# EAGLE board PX4mNode_V0_1_1 (EAGLE 6.5.0), part 1 of 2
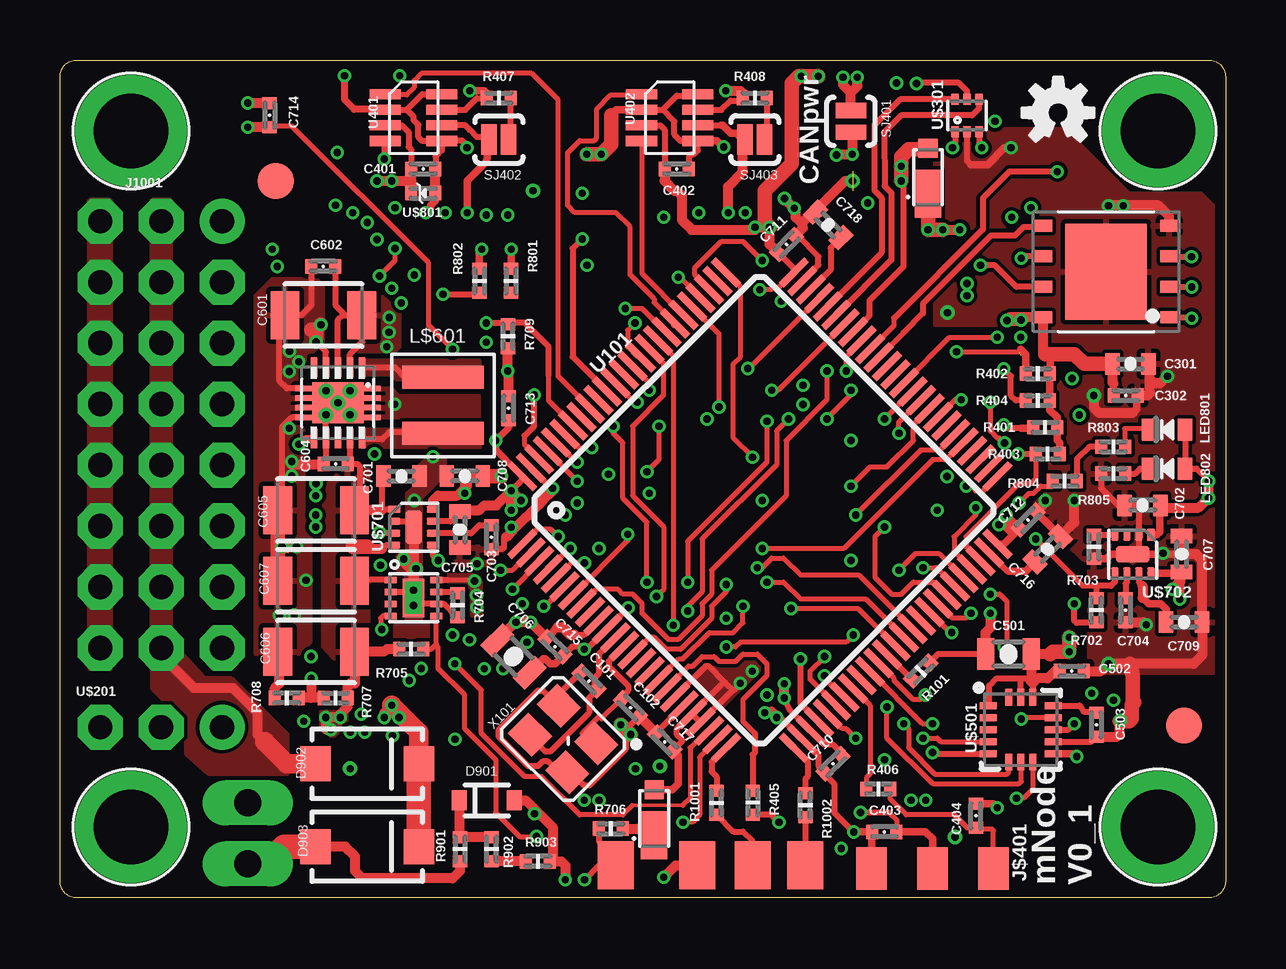
[diagram p11: board, top side]
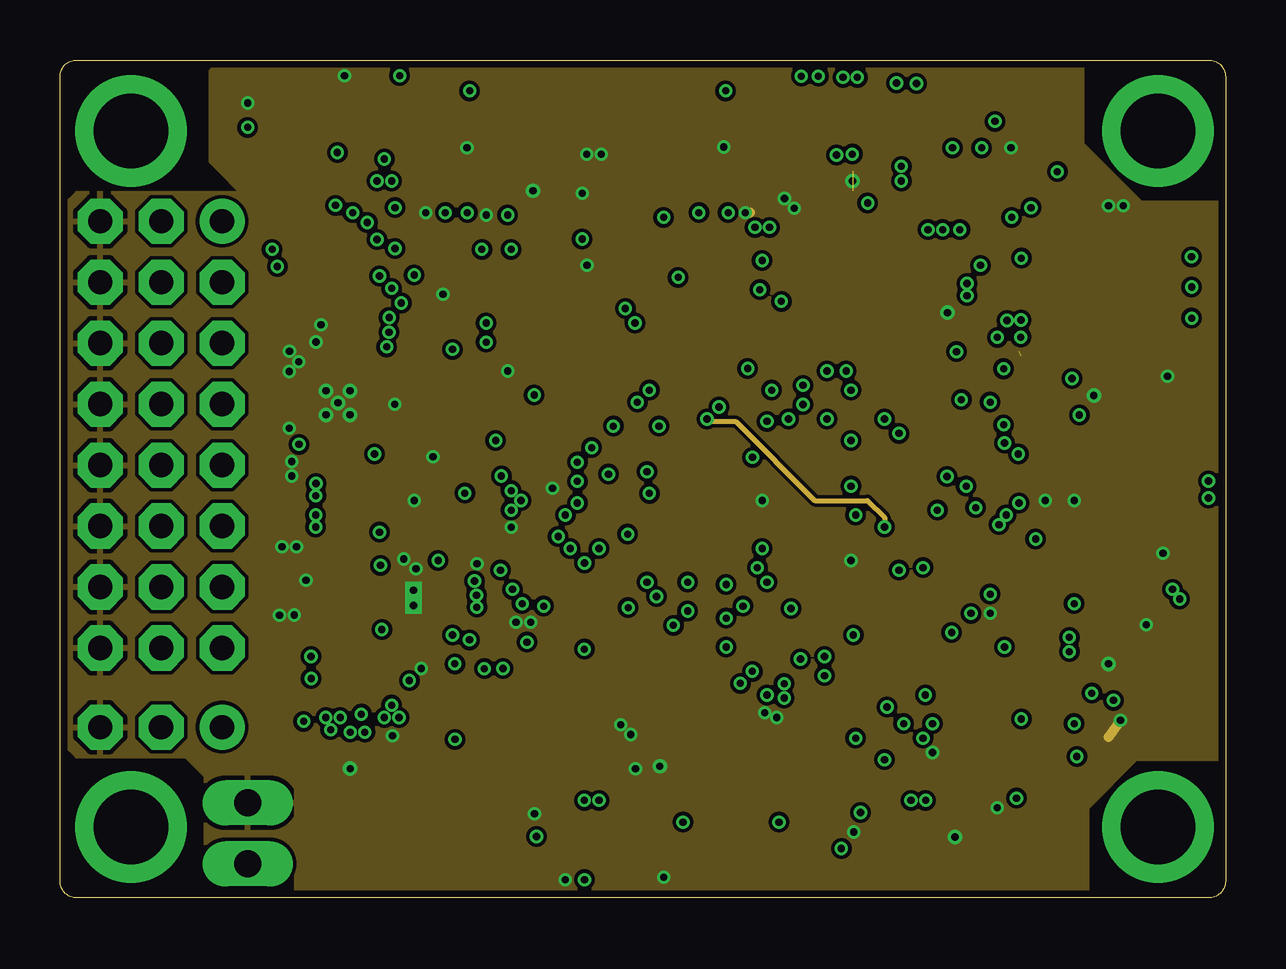
[diagram p12: board, inner layer Ground]
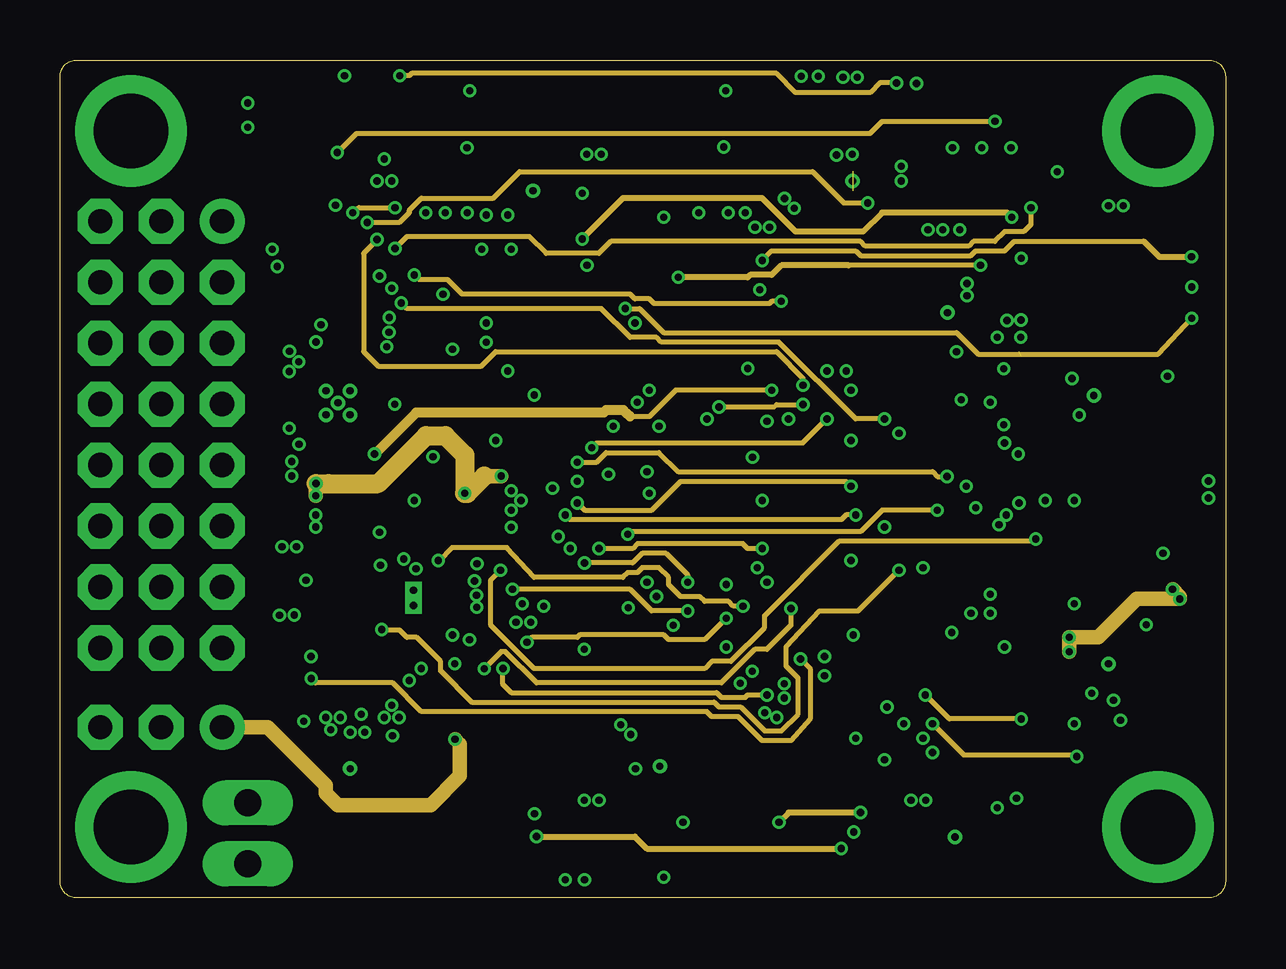
[diagram p13: board, inner layer Horizontal]
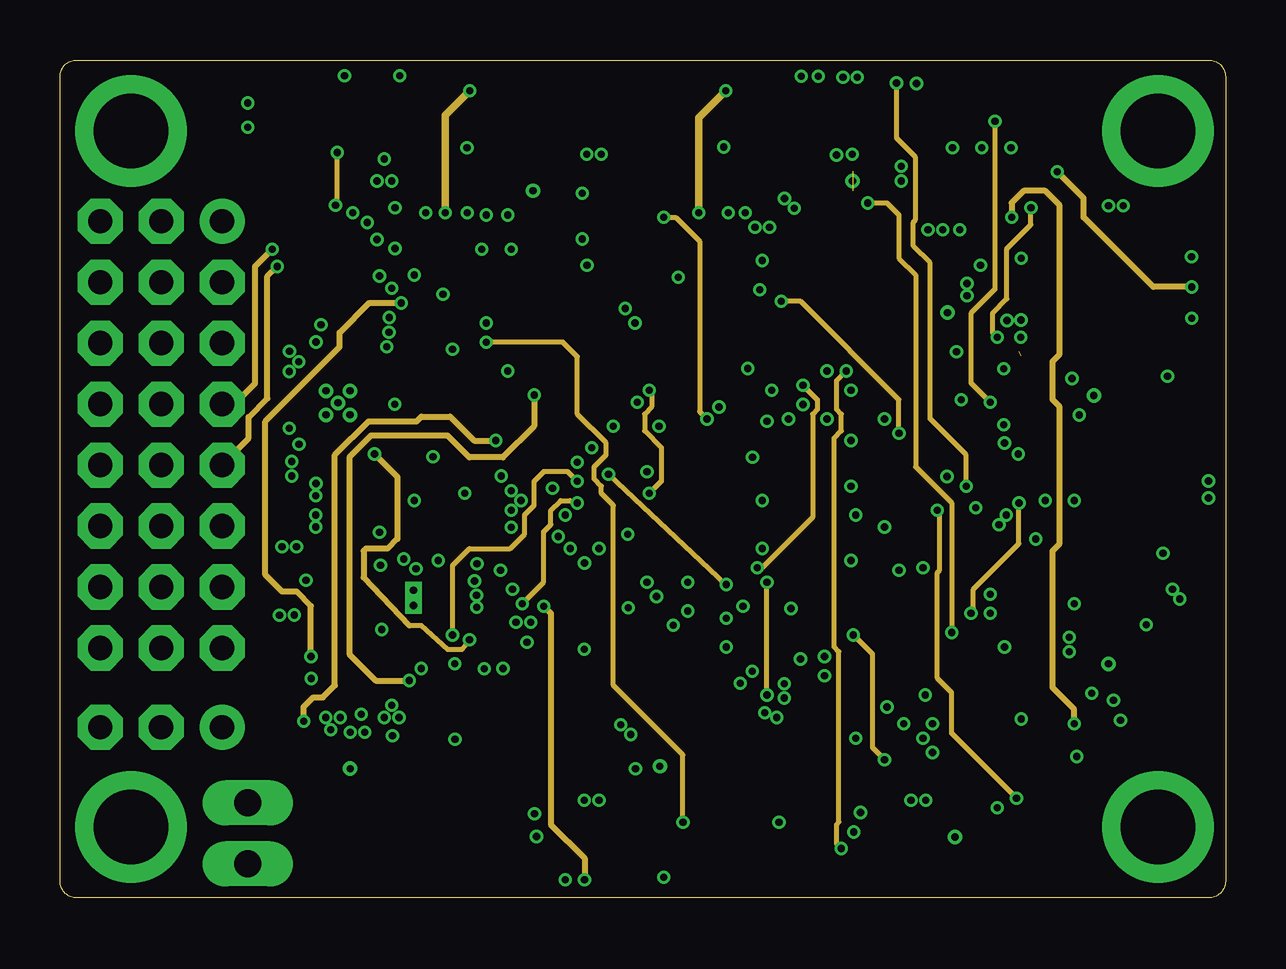
[diagram p14: board, inner layer Vertical]
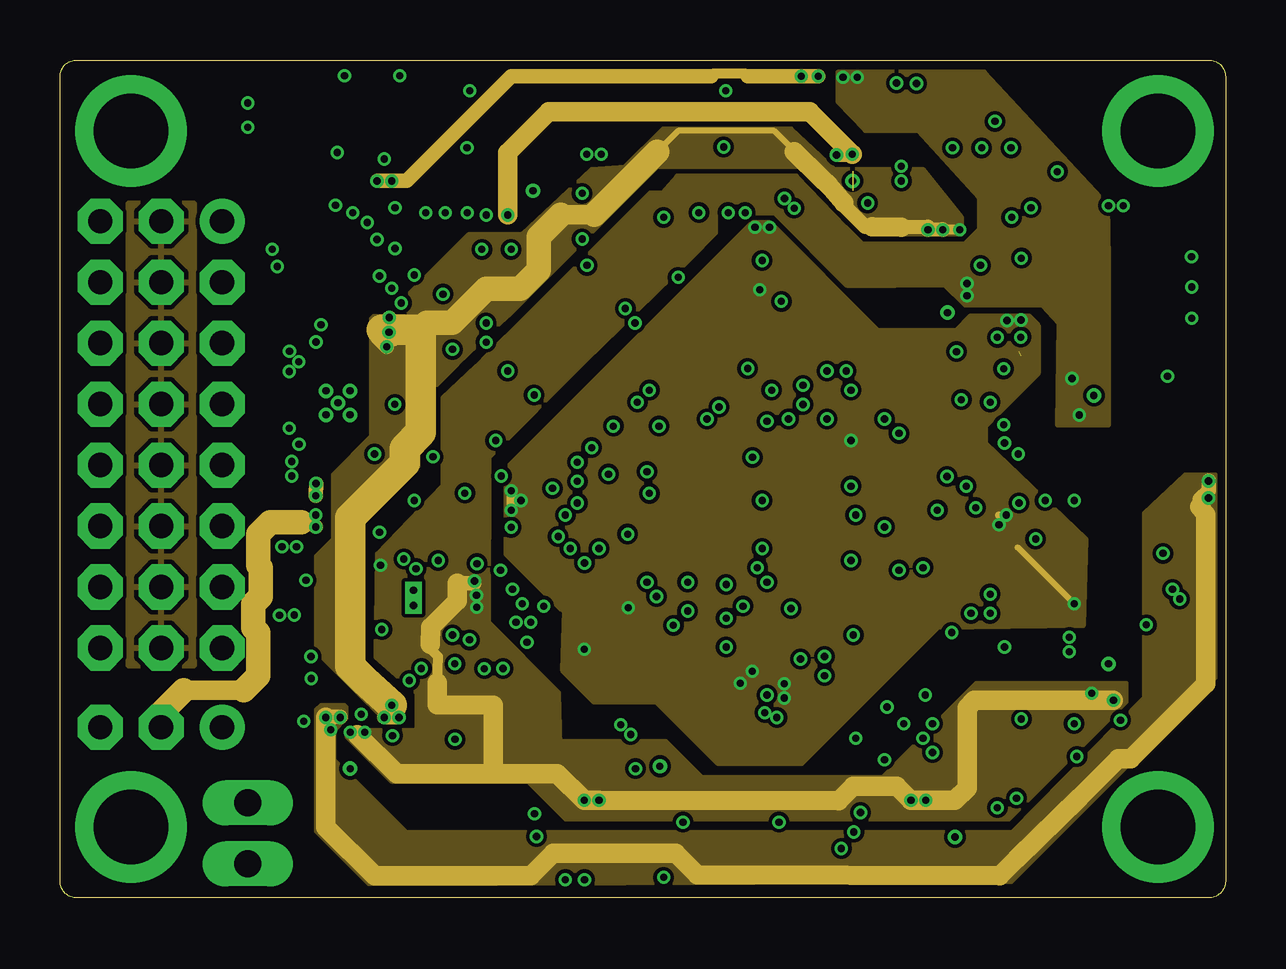
[diagram p15: board, inner layer Power]
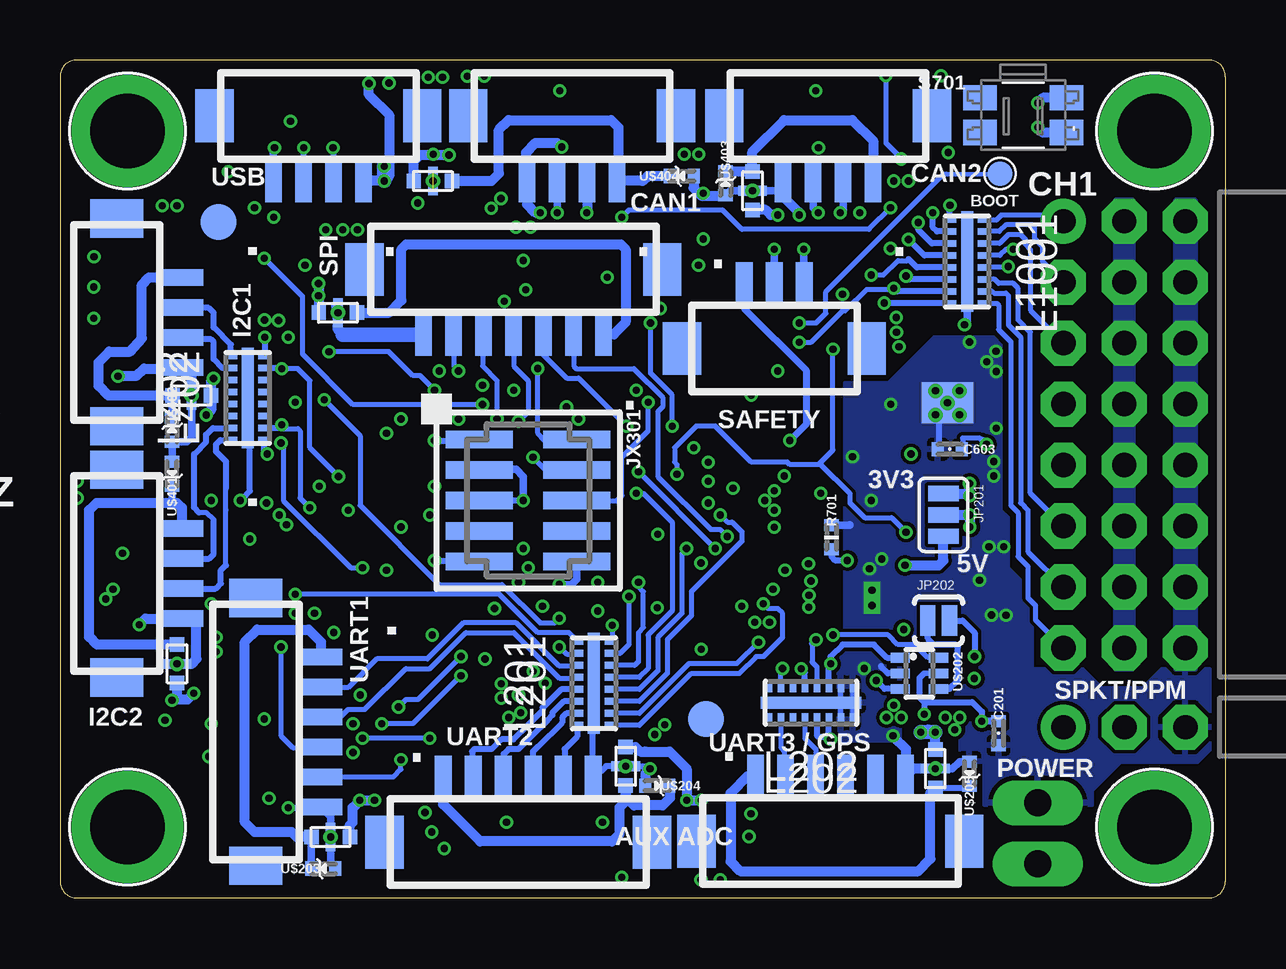
[diagram p16: board, bottom side, seen from below]

Size 48.56 x 34.91 mm. Coordinates in mm from the lower left corner, seen from the top.
Outline: 0,0.7 arc90 0.7,0 47.86,0 arc90 48.56,0.7 48.56,34.21 arc90 47.86,34.91 0.7,34.91 arc90 0,34.21
Outline: 0,0.68 0,34.21
Copper layers (1+2+3*14+15+16): Top 0.035mm / dielectric 0.2mm / Ground 0.035mm / dielectric 0.36mm / Horizontal 0.035mm / dielectric 0.28mm / Vertical 0.035mm / dielectric 0.36mm / Power 0.035mm / dielectric 0.2mm / Bottom 0.035mm
Design rules "PCB-POOL HighSpec_ML6 *": minimum track width 0.125mm, minimum drill 0.3mm, track to track 0.125mm, track to pad 0.125mm, pad to pad 0.125mm, via to via 0.125mm, smd to smd 0.125mm, copper to edge 0.3mm, drill to drill 0.2mm, minimum pad ring 0.125mm, minimum via ring 0.125mm, stop-mask expansion 0.075mm, vias tented up to drill 0.31mm, thermal gap 0.2mm
Net classes: 0 signal: width 0.152 mm, drill 0.2 mm, clearance 0.152 mm; 1 power: width 0.254 mm, drill 0.3 mm, clearance 0.152 mm

## Footprints (pad centres in the part's own frame; a part is rotated, then mirrored left to right if it is on the bottom)
PAD.04X.04 = smd 1.016 x 1.016: P$1 0,0
0402-CAP = smd 0.5 x 0.6: P$1 -0.5,0; P$2 0.5,0
0603-CAP = smd 0.6 x 0.9: P$1 -0.75,0; P$2 0.75,0
0805-CAP = smd 0.7 x 1.3: P$1 -0.95,0; P$2 0.95,0
1210 = smd 1.2 x 2: 1 -1.6,0; 2 1.6,0
MICROSMP = smd 0.8 x 0.8: ANODE 0.65,0 | smd 2 x 1.1: CATHODE -1.25,0
SOD-323 = smd 0.63 x 0.83: 1 -1.15,0; 2 1.15,0
SMA-DIODE = smd 1.27 x 1.47: A -2.15,0; C 2.15,0
DF13C-6P-1.25V = smd 1.6 x 2.2: M$0 5.575,-1.8; M$1 -5.575,-1.8 | smd 0.7 x 1.8: P$1 -3.125,0.9; P$2 -1.875,0.9; P$3 -0.625,0.9; P$4 0.625,0.9; P$5 1.875,0.9; P$6 3.125,0.9
DF13C-4P-1.25V = smd 1.6 x 2.2: M$0 4.325,-1.8; M$1 -4.325,-1.8 | smd 0.7 x 1.8: P$1 -1.875,0.9; P$2 -0.625,0.9; P$3 0.625,0.9; P$4 1.875,0.9
DF13C-7P-1.25V = smd 1.6 x 2.2: M$0 6.2,-1.8; M$1 -6.2,-1.8 | smd 0.7 x 1.8: P$1 -3.75,0.9; P$2 -2.5,0.9; P$3 -1.25,0.9; P$4 0,0.9; P$5 1.25,0.9; P$6 2.5,0.9; P$7 3.75,0.9
DF13C-3P-1.25V = smd 1.6 x 2.2: M$0 3.85,-1.8; M$1 -3.85,-1.8 | smd 0.7 x 1.8: P$1 -1.25,0.9; P$2 0,0.9; P$3 1.25,0.9
3X8RA_SERVO = drill 1.016 pad 1.88 octagon: GND_S1 -3.81,8.89; GND_S2 -3.81,6.35; GND_S3 -3.81,3.81; GND_S4 -3.81,1.27; GND_S5 -3.81,-1.27; GND_S6 -3.81,-3.81; GND_S7 -3.81,-6.35; GND_S8 -3.81,-8.89; PWR_S1 -1.27,8.89; PWR_S2 -1.27,6.35; PWR_S3 -1.27,3.81; PWR_S4 -1.27,1.27; PWR_S5 -1.27,-1.27; PWR_S6 -1.27,-3.81; PWR_S7 -1.27,-6.35; PWR_S8 -1.27,-8.89; S2 1.27,6.35; S3 1.27,3.81; S4 1.27,1.27; S5 1.27,-1.27; S6 1.27,-3.81; S7 1.27,-6.35; S8 1.27,-8.89 | drill 1.016 pad 1.88: S1 1.27,8.89
HEADER_3X01_SMD_H_BOARD_EDGE_SHORT = smd 1.27 x 1.778: 1 -2.54,0; 2 0,0; 3 2.54,0
SJ_3 = smd 0.635 x 1.27: 1 -0.889,0; 2 0,0; 3 0.889,0
SJ_2S-NO = smd 0.635 x 1.27: 1 -0.45,0; 2 0.45,0
PAD-1.5X4.5 = smd 1.5 x 2: P$1 0,0
1X02_LONGPADS = drill 1.118 pad 1.88 long: 1 0,0; 2 2.54,0
FIDUCIAL-1.5X3 = smd 1.5 x 1.5: 1 0,0
FTSH-105-01-XXX-DV-K = smd 0.737 x 2.794: 1 -2.54,-2.032; 2 -2.54,2.032; 3 -1.27,-2.032; 4 -1.27,2.032; 5 0,-2.032; 6 0,2.032; 7 1.27,-2.032; 8 1.27,2.032; 9 2.54,-2.032; 10 2.54,2.032
DFN16-THIN = smd 0.28 x 0.51: P$1 -1.75,-0.7; P$2 -1.25,-0.7; P$3 -0.75,-0.7; P$4 -0.25,-0.7; P$5 0.25,-0.7; P$6 0.75,-0.7; P$7 1.25,-0.7; P$8 1.75,-0.7; P$9 1.75,0.7; P$10 1.25,0.7; P$11 0.75,0.7; P$12 0.25,0.7; P$13 -0.25,0.7; P$14 -0.75,0.7; P$15 -1.25,0.7; P$16 -1.75,0.7 | smd 4.2 x 0.5: P$EP 0,0
KYOCERA-KNH16-DA = smd 0.6 x 0.6: P$1 -0.8,0; P$2 0.8,0 | smd 0.4 x 0.4: P$3 0,-0.4; P$4 0,0.4 | drill 0.3 pad 0.6: P$5 0,0
XFL4020 = smd 0.965 x 3.404: 1 -1.168,0; 2 1.168,0
0603-LED = smd 0.6 x 0.9: A 0.75,0; C -0.75,0
MOUNT-HOLE3.1 = drill 3.1 pad 4.1: P$1 0,0
0402-RES = smd 0.5 x 0.6: P$1 -0.5,0; P$2 0.5,0
EVQP7J01K = smd 1.4 x 1.05: A1 -1.8,0.725; A2 1.8,0.725; B3 -1.8,-0.725; B4 1.8,-0.725
SJ_2S-NOTRACE = smd 0.635 x 1.27: 1 -0.401,0; 2 0.413,0
TQFP100 = smd 1.5 x 0.29: 1 -8,6; 2 -8,5.5; 3 -8,5; 4 -8,4.5; 5 -8,4; 6 -8,3.5; 7 -8,3; 8 -8,2.5; 9 -8,2; 10 -8,1.5; 11 -8,1; 12 -8,0.5; 13 -8,0; 14 -8,-0.5; 15 -8,-1; 16 -8,-1.5; 17 -8,-2; 18 -8,-2.5; 19 -8,-3; 20 -8,-3.5; 21 -8,-4; 22 -8,-4.5; 23 -8,-5; 24 -8,-5.5; 25 -8,-6; 51 8,-6; 52 8,-5.5; 53 8,-5; 54 8,-4.5; 55 8,-4; 56 8,-3.5; 57 8,-3; 58 8,-2.5; 59 8,-2; 60 8,-1.5; 61 8,-1; 62 8,-0.5; 63 8,0; 64 8,0.5; 65 8,1; 66 8,1.5; 67 8,2; 68 8,2.5; 69 8,3; 70 8,3.5; 71 8,4; 72 8,4.5; 73 8,5; 74 8,5.5; 75 8,6 | smd 0.29 x 1.5: 26 -6,-8; 27 -5.5,-8; 28 -5,-8; 29 -4.5,-8; 30 -4,-8; 31 -3.5,-8; 32 -3,-8; 33 -2.5,-8; 34 -2,-8; 35 -1.5,-8; 36 -1,-8; 37 -0.5,-8; 38 0,-8; 39 0.5,-8; 40 1,-8; 41 1.5,-8; 42 2,-8; 43 2.5,-8; 44 3,-8; 45 3.5,-8; 46 4,-8; 47 4.5,-8; 48 5,-8; 49 5.5,-8; 50 6,-8; 76 6,8; 77 5.5,8; 78 5,8; 79 4.5,8; 80 4,8; 81 3.5,8; 82 3,8; 83 2.5,8; 84 2,8; 85 1.5,8; 86 1,8; 87 0.5,8; 88 0,8; 89 -0.5,8; 90 -1,8; 91 -1.5,8; 92 -2,8; 93 -2.5,8; 94 -3,8; 95 -3.5,8; 96 -4,8; 97 -4.5,8; 98 -5,8; 99 -5.5,8; 100 -6,8
SOT23-8 = smd 0.42 x 1.3: 1 -0.975,-1.175; 2 -0.325,-1.175; 3 0.325,-1.175; 4 0.975,-1.175; 5 0.975,1.175; 6 0.325,1.175; 7 -0.325,1.175; 8 -0.975,1.175
3X1RA = drill 1.016 pad 1.88: 1 5.08,0 | drill 1.016 pad 1.88 octagon: 2 2.54,0; 3 0,0
SOT363_PHILIPS = smd 0.4 x 0.8: 1 -0.65,-0.8; 2 0,-0.8; 3 0.65,-0.8; 4 0.65,0.8; 5 0,0.8; 6 -0.65,0.8
0402-TVS = smd 0.5 x 0.6: A 0.5,0; C -0.5,0
SOT563-6 = smd 0.3 x 0.45: 1 -0.5,-0.675; 2 0,-0.675; 3 0.5,-0.675; 4 0.5,0.675; 5 0,0.675; 6 -0.5,0.675
WSON-8-5X6 = smd 0.5 x 0.75: 1 -1.905,-2.625; 2 -0.635,-2.625; 3 0.635,-2.625; 4 1.905,-2.625; 5 1.905,2.625; 6 0.635,2.625; 7 -0.635,2.625; 8 -1.905,2.625 | smd 4 x 3.4: PAD 0,0
16LGA-3X3 = smd 0.7 x 0.3: 1 -1.35,1; 2 -1.35,0.5; 3 -1.35,0; 4 -1.35,-0.5; 5 -1.35,-1; 9 1.35,-1; 10 1.35,-0.5; 11 1.35,0; 12 1.35,0.5; 13 1.35,1 | smd 0.3 x 0.7: 6 -0.5,-1.35; 7 0,-1.35; 8 0.5,-1.35; 14 0.5,1.35; 15 0,1.35; 16 -0.5,1.35
PWSON10 = smd 0.28 x 0.85: 1 -1,-1.475; 2 -0.5,-1.475; 3 0,-1.475; 4 0.5,-1.475; 5 1,-1.475; 10 1,1.475; 11 0.5,1.475; 12 0,1.475; 13 -0.5,1.475; 14 -1,1.475 | smd 0.7 x 0.23: 6 1.425,-0.6; 7 1.425,-0.2; 8 1.425,0.2; 9 1.425,0.6; 15 -1.425,0.6; 16 -1.425,0.2; 17 -1.425,-0.2; 18 -1.425,-0.6 | drill 0.3 pad 0.61: 19 0.5,0.5; 20 0.5,-0.5; 21 -0.5,-0.5; 22 -0.5,0.5; 23 0,0 | smd 2.15 x 1.7: EP 0,0 | smd 2.15 x 1.7 bottom: EP1 0,0
MLF-8-EPAD = smd 0.5 x 0.3: 1 -0.8,0.75; 2 -0.8,0.25; 3 -0.8,-0.25; 4 -0.8,-0.75; 5 0.8,-0.75; 6 0.8,-0.25; 7 0.8,0.25; 8 0.8,0.75 | smd 0.7 x 1.4: GND 0,0
QFN8-DSG = smd 0.28 x 0.5: 1 -0.75,-0.95; 2 -0.25,-0.95; 3 0.25,-0.95; 4 0.75,-0.95; 5 0.75,0.95; 6 0.25,0.95; 7 -0.25,0.95; 8 -0.75,0.95 | smd 1.6 x 0.9: GND 0,0 | drill 0.3 pad 0.7 square: P$2 -0.317,0; P$3 0.317,0
OSCILLATOR-3.2X2.5 = smd 1.4 x 1.2: 1 -1.1,-0.85; 2 1.1,-0.85; 3 1.1,0.85; 4 -1.1,0.85

## Placement (x,y rotation side)
BOOT  PAD.04  [PAD.04X.04]  9.4,30.18 0 bottom
C101  8p  [0402-CAP]  22.05,9.04 135 top
C102  8p  [0402-CAP]  23.78,7.92 135 top
C201  0u1  [0402-CAP]  9.46,6.86 270 bottom
C301  2u2  [0603-CAP]  44.6,22.25 0 top
C302  0u1  [0402-CAP]  44.4,20.93 0 top
C401  0u1  [0402-CAP]  15.14,30.38 0 top
C402  0u1  [0402-CAP]  25.71,30.38 0 top
C403  0u1  [0402-CAP]  34.35,2.75 180 top
C404  0u1  [0402-CAP]  38.16,3.42 90 top
C501  10u/10V  [0805-CAP]  39.52,10.16 180 top
C502  10n  [0402-CAP]  42.16,9.45 0 top
C503  0u1  [0402-CAP]  43.18,7.21 270 top
C601  22uF  [1210]  10.97,24.28 180 top
C602  0u1  [0402-CAP]  10.97,26.31 180 top
C603  0u1  [0402-CAP]  11.48,18.69 180 bottom
C604  0u1  [0402-CAP]  11.48,18.08 180 top
C605  22uF  [1210]  10.67,16.15 180 top
C606  22uF  [1210]  10.67,10.26 180 top
C607  22uF  [1210]  10.67,13.21 180 top
C701  2u2  [0603-CAP]  14.22,17.58 0 top
C702  1u0  [0603-CAP]  45.11,16.36 180 top
C703  10n  [0402-CAP]  17.98,15.04 90 top
C704  10n  [0402-CAP]  44.4,11.99 270 top
C705  1u0  [0603-CAP]  16.66,15.34 270 top
C706  10u/10V  [0805-CAP]  18.9,10.06 135 top
C707  1u0  [0603-CAP]  46.74,14.33 90 top
C708  1u0  [0603-CAP]  16.87,17.58 180 top
C709  1u0  [0603-CAP]  46.84,11.49 0 top
C710  0u1  [0402-CAP]  32.21,5.59 225 top
C711  0u1  [0402-CAP]  30.28,27.23 45 top
C712  0u1  [0402-CAP]  40.34,15.75 45 top
C713  0u1  [0402-CAP]  18.69,20.4 90 top
C714  0u1  [0402-CAP]  8.74,32.61 270 top
C715  0u1  [0402-CAP]  20.63,10.46 135 top
C716  2u2  [0603-CAP]  41.15,14.53 45 top
C717  0u1  [0402-CAP]  25.2,6.5 135 top
C718  2u2  [0603-CAP]  32,28.04 135 top
D701  MSS1P4-M3  [MICROSMP]  24.76,3.86 90 top
D901  [SOD-323]  17.78,4.06 0 top
D902  B340A  [SMA-DIODE]  12.8,5.59 0 top
D903  B340A  [SMA-DIODE]  12.8,2.13 0 top
D904  MSS1P4-M3  [MICROSMP]  36.17,30.58 90 top
J201  DF13C-6P-1.25V  [DF13C-6P-1.25V]  38.6,6.92 270 bottom
J202  DF13C-6P-1.25V  [DF13C-6P-1.25V]  29.47,4.12 0 bottom
J203  DF13C-6P-1.25V  [DF13C-6P-1.25V]  16.46,4.17 0 bottom
J301  DF13C-4P-1.25V  [DF13C-4P-1.25V]  37.8,30.78 180 bottom
J401  DF13C-7P-1.25V  [DF13C-7P-1.25V]  29.67,24.38 180 bottom
J402  DF13C-4P-1.25V  [DF13C-4P-1.25V]  44.4,13.51 270 bottom
J403  DF13C-4P-1.25V  [DF13C-4P-1.25V]  44.4,23.98 270 bottom
J404  DF13C-4P-1.25V  [DF13C-4P-1.25V]  16.56,30.78 180 bottom
J405  DF13C-4P-1.25V  [DF13C-4P-1.25V]  27.23,30.78 180 bottom
J801  DF13C-3P-1.25V  [DF13C-3P-1.25V]  18.8,24.69 0 bottom
J1001  [3X8RA_SERVO]  5.49,19.3 0 top
J$401  HEADER-3X1BOARDEDGE-SHORT  [HEADER_3X01_SMD_H_BOARD_EDGE_SHORT]  36.36,1.22 180 top
JP201  JUMPER-3SMD  [SJ_3]  11.76,15.96 270 bottom
JP202  [SJ_2S-NO]  11.96,11.56 0 bottom
JP701  M01SMD-4.5X1.5  [PAD-1.5X4.5]  23.16,1.36 0 top
JP702  M01SMD-4.5X1.5  [PAD-1.5X4.5]  26.55,1.36 0 top
JP901  M02PTH3  [1X02_LONGPADS]  7.82,1.42 90 top
JP1001  M01SMD-4.5X1.5  [PAD-1.5X4.5]  28.86,1.36 0 top
JP1002  M01SMD-4.5X1.5  [PAD-1.5X4.5]  31.05,1.36 0 top
JP1101  FIDUCIAL1.5X3  [FIDUCIAL-1.5X3]  41.96,28.16 0 bottom
JP1102  FIDUCIAL1.5X3  [FIDUCIAL-1.5X3]  21.66,7.46 0 bottom
JP1103  FIDUCIAL1.5X3  [FIDUCIAL-1.5X3]  8.99,29.87 0 top
JP1104  FIDUCIAL1.5X3  [FIDUCIAL-1.5X3]  46.84,7.18 0 top
JX301  ARM_MINI_JTAG-SMT  [FTSH-105-01-XXX-DV-K]  29.06,16.56 270 bottom
L201  NUF8402MN  [DFN16-THIN]  26.32,8.94 90 bottom
L202  NUF8402MN  [DFN16-THIN]  17.27,8.13 180 bottom
L203  KNH16C104DA5TS  [KYOCERA-KNH16-DA]  37.29,2.54 180 bottom
L204  KNH16C104DA5TS  [KYOCERA-KNH16-DA]  24.99,5.49 270 bottom
L205  KNH16C104DA5TS  [KYOCERA-KNH16-DA]  12.09,5.38 270 bottom
L401  KNH16C104DA5TS  [KYOCERA-KNH16-DA]  36.98,24.38 0 bottom
L402  NUF8402MN  [DFN16-THIN]  40.74,20.83 90 bottom
L403  KNH16C104DA5TS  [KYOCERA-KNH16-DA]  43.69,9.75 90 bottom
L404  KNH16C104DA5TS  [KYOCERA-KNH16-DA]  43.08,20.93 180 bottom
L405  KNH16C104DA5TS  [KYOCERA-KNH16-DA]  19.71,29.46 90 bottom
L406  KNH16C104DA5TS  [KYOCERA-KNH16-DA]  33.02,29.87 0 bottom
L1001  NUF8402MN  [DFN16-THIN]  10.77,26.52 270 bottom
L$601  XFL4020-222MEB  [XFL4020]  15.95,20.52 90 top
LED801  AMBER  [0603-LED]  46.13,19.51 0 top
LED802  GREEN  [0603-LED]  46.13,17.88 0 top
M3_MOUNT1101  MOUNT-HOLE3.1MM  [MOUNT-HOLE3.1]  2.96,31.96 0 top
M3_MOUNT1102  MOUNT-HOLE3.1MM  [MOUNT-HOLE3.1]  45.76,2.96 0 top
M3_MOUNT1103  MOUNT-HOLE3.1MM  [MOUNT-HOLE3.1]  45.76,31.96 0 top
M3_MOUNT1104  MOUNT-HOLE3.1MM  [MOUNT-HOLE3.1]  2.96,2.96 0 top
OSHW_LOGO  OSHW-LOGOS  [OSHW-LOGO-S]  41.59,32.71 0 top
R101  10K  [0402-RES]  35.87,9.45 45 top
R401  1K5  [0402-RES]  41.05,19.61 0 top
R402  1K5  [0402-RES]  40.74,21.84 0 top
R403  1K5  [0402-RES]  41.15,18.49 0 top
R404  1K5  [0402-RES]  40.74,20.73 0 top
R405  10K/0.1%  [0402-RES]  28.86,3.97 270 top
R406  10K/0.1%  [0402-RES]  34.1,4.54 0 top
R407  120R  [0402-RES]  18.29,33.32 0 top
R408  120R  [0402-RES]  28.96,33.32 0 top
R701  10K  [0402-RES]  16.41,15.02 270 bottom
R702  10K  [0402-RES]  43.18,11.99 90 top
R703  10K  [0402-RES]  43.08,14.63 90 top
R704  47K  [0402-RES]  16.56,12.19 270 top
R705  10K  [0402-RES]  14.63,10.37 0 top
R706  1K  [0402-RES]  22.95,2.89 0 top
R707  10K/0.1%  [0402-RES]  11.48,8.33 0 top
R708  10K/0.1%  [0402-RES]  9.45,8.33 180 top
R709  10K  [0402-RES]  18.67,23.4 90 top
R801  47R  [0402-RES]  18.8,25.7 270 top
R802  1K5  [0402-RES]  17.48,25.7 270 top
R803  220R  [0402-RES]  43.89,18.8 0 top
R804  220R  [0402-RES]  41.86,17.37 0 top
R805  220R  [0402-RES]  43.89,17.68 0 top
R901  10K/0.1%  [0402-RES]  16.66,2.03 270 top
R902  10K/0.1%  [0402-RES]  17.98,2.03 90 top
R903  10K/0.1%  [0402-RES]  19.91,1.52 180 top
R1001  220R  [0402-RES]  27.36,3.96 90 top
R1002  220R  [0402-RES]  31.05,3.86 90 top
S701  RESET  [EVQP7J01K]  8.43,32.61 180 bottom
SJ401  SOLDERJUMPERNO  [SJ_2S-NO]  32.96,32.36 270 top
SJ402  SOLDERJUMPERNC2  [SJ_2S-NOTRACE]  18.29,31.6 180 top
SJ403  SOLDERJUMPERNC2  [SJ_2S-NOTRACE]  28.96,31.6 180 top
U101  STM32F4X7VX  [TQFP100]  29.16,16.15 45 top
U401  MAX3051  [SOT23-8]  14.73,32.51 270 top
U402  MAX3051  [SOT23-8]  25.4,32.51 270 top
U$201  HEADER-3X1RA  [3X1RA]  1.68,7.11 0 top
U$202  74LVC2GU04  [SOT363_PHILIPS]  12.76,9.36 270 bottom
U$203  PESD0402-140  [0402-TVS]  37.59,1.22 0 bottom
U$204  PESD0402-140  [0402-TVS]  23.67,4.67 180 bottom
U$205  PESD0402-140  [0402-TVS]  10.67,5.18 90 bottom
U$301  NUF2042XV6  [SOT563-6]  37.8,32.6 0 top
U$302  W25Q64FV  [WSON-8-5X6]  43.59,26.1 90 top
U$401  PESD0402-140  [0402-TVS]  43.89,17.68 90 bottom
U$402  PESD0402-140  [0402-TVS]  43.89,19.51 270 bottom
U$403  PESD0402-140  [0402-TVS]  20.83,29.77 270 bottom
U$404  PESD0402-140  [0402-TVS]  22.66,30.07 0 bottom
U$501  MAX21100  [16LGA-3X3]  40.03,7.01 0 top
U$601  TPS6303X  [PWSON10]  11.58,20.62 180 top
U$701  MIC5332  [MLF-8-EPAD]  14.73,15.44 0 top
U$702  MIC5332  [MLF-8-EPAD]  44.7,14.33 270 top
U$703  BQ24315  [QFN8-DSG]  14.73,12.5 270 top
U$801  PESD0402-140  [0402-TVS]  15.14,29.36 0 top
X101  3.2x2.5 mm / 24 MHz / 15 ppm  [OSCILLATOR-3.2X2.5]  20.96,6.62 135 top

## Tracks (layer width: path | path; a pad name or v marks a point on that pad's centre or on a via)
5V_CAN_CONN  (via drill 0.3, 0.3 pad 0.55)
  Top 0.406: SJ401.2 33.01,31.85 v33.01,30.99 32.98,30.96 v32.36,30.96
  Power 0.61: v32.36,30.96 33.05,30.96
  Power 0.813: v33.01,30.99 31.24,32.76 20.36,32.76 18.66,31.06 v18.66,28.46
  Bottom 0.406: L406.P$1 33.82,30.7 33.63,30.89 33.6,30.96 v32.36,30.96 | v18.66,28.46 18.95,28.46 19.16,28.66 L405.P$1
5V_S1_FILTERED
  Bottom 0.305: U$203.C L203.P$2
  Bottom 0.406: L203.P$2 38.71,2.54 38.91,2.74 40.45,2.74 40.86,3.15 40.86,10.67 40.35,11.18 38.2,11.18 37.69,10.67 J201.P$1
5V_S2_FILTERED
  Bottom 0.406: U$204.C 23.16,4.67 23.16,4.16 23.46,3.86 24.66,3.86 24.99,4.2 L204.P$2 24.99,4.02 25.26,3.76 25.26,2.66 25.55,2.36 31.05,2.36 32.6,3.9 J202.P$1
5V_S3_FILTERED
  Bottom 0.254: L205.P$2 10.77,4.58 U$205.C
  Bottom 0.406: J203.P$1 19.93,5.07 20.62,4.37 20.62,1.52 20.22,1.12 12.8,1.12 12.29,1.63 12.29,4.38 L205.P$2
!FMU-LED_AMBER  (via drill 0.3 pad 0.55)
  Top 0.2: v39.96,16.46 40.36,16.86 40.55,16.86 40.86,17.16 41.36,17.16 41.36,17.36 R804.P$1 | v37.96,11.86 37.76,11.66 37.19,11.66 U101.43 36.66,12.26
  Vertical 0.2: v39.96,16.46 39.96,14.76 38.05,12.86 38.05,12.06 v37.96,11.86
!GYRO_CS  (via drill 0.3)
  Top 0.2: U$501.8 40.53,4.53 40.16,4.16 v39.86,4.16 | v23.66,15.16 23.66,14.89 U101.7
  Horizontal 0.2: v36.55,16.16 34.26,16.16 33.36,15.26 23.86,15.26 v23.66,15.16
  Vertical 0.2: v39.86,4.16 37.16,6.86 37.16,8.56 36.55,9.16 36.55,13.56 36.66,13.66 36.66,16.06 v36.55,16.16
!SPI_EXT_NSS  (via drill 0.3 pad 0.55)
  Top 0.2: v18.86,12.86 19.95,13.96 U101.3 | v26.16,11.96 26.16,12.16 26.76,12.76 26.76,14.96 29.86,18.06 29.86,19.46 v30.36,19.96
  Horizontal 0.2: v18.86,12.86 23.76,12.86 24.66,11.96 v26.16,11.96
  Bottom 0.2: v30.36,19.96 30.36,21.56 30.96,22.16 30.96,23.46 J401.P$5
!VDD_5V_PERIPH_EN  (via drill 0.3 pad 0.55)
  Top 0.2: v32.76,21.96 32.76,22.56 33.36,23.16 U101.67 | v19.86,2.56 19.16,2.56 18.16,3.56 18.16,5.76 16.86,7.06 16.86,8.46 15.76,9.56 15.76,10.46 15.65,10.56 | R705.P$2 15.47,10.37 15.65,10.56 | 15.65,10.56 15.68,10.58 U$703.5
  Horizontal 0.254: v19.86,2.56 23.96,2.56 24.46,2.06 v32.55,2.06
  Vertical 0.2: v32.76,21.96 32.36,21.56 32.36,20.36 32.55,20.16 32.55,19.46 32.26,19.16 32.26,10.46 32.46,10.26 32.46,3.16 32.36,3.06 32.36,2.26 v32.55,2.06
!VDD_5V_PERIPH_OC  (via drill 0.3 pad 0.55)
  Top 0.2: v34.96,13.66 35.66,14.36 36.61,14.36 U101.46 | U$703.4 13.45,11.75 13.36,11.66 13.36,11.24 v13.41,11.18
  Horizontal 0.2: v34.96,13.66 33.26,11.96 31.66,11.96 30.26,10.46 30.26,9.66 30.76,9.16 30.76,7.66 30.05,6.96 29.36,6.96 28.36,7.96 27.46,7.96 27.26,8.16 17.16,8.16 15.86,9.46 15.86,9.86 14.86,10.86 14.46,10.86 14.15,11.16 13.44,11.16 v13.41,11.18
ACCEL_DRDY  (via drill 0.3)
  Top 0.254: U$501.11 42.01,7.01 v42.26,7.26 | v21.76,27.46 21.36,27.06 21.36,22.54 U101.90
  Horizontal 0.254: v39.66,28.36 39.46,28.56 34.26,28.56 33.46,27.76 30.66,27.76 29.26,29.16 23.46,29.16 v21.76,27.46
  Vertical 0.254: v42.26,7.26 42.26,7.86 41.36,8.76 41.36,14.46 41.66,14.76 41.66,20.46 41.36,20.76 41.36,22.36 41.66,22.66 41.66,28.86 41.05,29.46 40.16,29.46 39.66,28.96 v39.66,28.36
CAN1_H  (via drill 0.3 pad 0.55)
  Top 0.254: U402.7 27.55,32.84 27.94,33.22 28.36,33.22 R408.P$1
  Top 0.305: 28.45,33.53 R408.P$1
  Top 0.406: v27.74,33.63 28.35,33.63 28.45,33.53
  Vertical 0.305: v26.62,28.55 26.62,32.51 v27.74,33.63
  Bottom 0.406: J405.P$2 26.6,28.56 v26.62,28.55
CAN1_L  (via drill 0.3 pad 0.55)
  Top 0.254: U402.6 27.55,32.19 | 28.26,31.76 28.29,31.76
  Top 0.305: 27.55,32.19 27.62,32.19 27.96,31.86 28.19,31.86 28.29,31.76 SJ403.2
  Top 0.406: v27.84,28.55 27.84,29.64 28.46,30.26 28.46,31.59 SJ403.2
  Bottom 0.305: v27.84,28.55 27.84,29.87 J405.P$3
CAN1_RX
  Top 0.2: U402.4 24.26,31.46 24.26,26.01 U101.81 25.96,24.26
CAN1_TX
  Top 0.2: U402.1 24.16,33.46 22.96,33.46 22.36,32.86 22.36,31.66 22.26,31.56 21.66,31.56 21.16,31.06 21.16,28.86 21.45,28.56 23.16,28.56 23.76,27.96 23.76,25.96 24.76,24.96 24.76,24.8 U101.82 25.55,23.86
CAN2_H  (via drill 0.3 pad 0.55)
  Top 0.254: U401.7 16.89,32.84 17.37,33.32 R407.P$1
  Top 0.305: v17.07,33.63 17.68,33.63 17.78,33.53 R407.P$1
  Vertical 0.305: v16.05,28.55 16.05,32.61 v17.07,33.63
  Bottom 0.305: J404.P$2 15.94,28.67 v16.05,28.55
CAN2_L  (via drill 0.3 pad 0.55)
  Top 0.254: SJ402.2 17.68,31.7 17.37,31.7 17.07,32 16.89,32.19 U401.6
  Top 0.305: v16.97,28.55 16.97,29.87 17.78,30.68 SJ402.2
  Bottom 0.305: J404.P$3 17.19,28.76 v16.97,28.55
CAN2_RX  (via drill 0.3 pad 0.55)
  Top 0.2: v37.76,17.16 37.96,17.16 38.16,16.96 38.26,16.96 38.36,16.86 U101.51
  Top 0.305: v13.51,30.78 13.56,30.83 U401.4
  Top 0.406: U401.4 13.51,31.54
  Horizontal 0.2: v14.15,34.26 14.56,34.26 14.65,34.36 29.86,34.36 30.66,33.56 33.76,33.56 34.16,33.96 v34.86,33.96
  Vertical 0.2: v34.86,33.96 34.86,31.66 35.66,30.86 35.66,28.26 35.55,28.16 35.55,27.16 36.26,26.46 36.26,19.96 37.76,18.46 v37.76,17.16
  Bottom 0.2: v14.15,34.26 14.15,31.46 13.56,30.86 v13.51,30.78
CAN2_TX
  Top 0.2: U401.1 13.65,33.46 14.46,33.46 14.76,33.76 14.76,34.06 15.06,34.36 19.66,34.36 20.76,33.26 20.76,21.73 U101.92
FMU-!RESET  (via drill 0.3 pad 0.55)
  Top 0.2: v27.76,13.06 27.76,12.76 27.16,12.16 27.16,11.66 25.86,10.36 25.26,10.36 24.76,10.86 24.57,10.86 U101.14 | v16.36,22.86 15.36,23.86 15.36,26.46 9.65,32.16 8.65,32.16 C714.P$2
  Top 0.254: U$701.3 13.36,15.19 v13.31,15.24
  Top 0.406: C714.P$2 v7.83,32.11 v7.82,32.11
  Vertical 0.2: v22.86,17.66 v27.76,13.06
  Bottom 0.2: v22.86,17.66 22.86,18.06 22.96,18.16 22.96,18.76 22.05,19.66 21.26,19.66 19.76,18.16 18.26,18.16 18.16,18.06 16.86,18.06 | 16.86,18.06 15.65,16.86 15.65,16.46 15.04,15.84 13.91,15.84 v13.31,15.24 | 16.86,18.06 16.91,18.11 16.36,18.66 v16.36,22.86
  Bottom 0.305: v27.76,13.06 27.26,13.06 27.03,13.29 JX301.10
  Bottom 0.406: S701.A1 7.61,31.89 v7.82,32.11
FMU-BOOT0  (via drill 0.3 pad 0.55)
  Top 0.2: 20.36,21.76 20.36,20.72 U101.94 21.36,19.66
  Top 0.254: v17.76,23.96 18.61,23.96 R709.P$2 18.72,23.96 19.36,23.96 20.36,22.96 20.36,21.76
  Bottom 0.2: v17.76,23.96 17.05,23.96 16.66,24.36 16.66,25.26 11.76,30.16 11.65,30.16 BOOT.P$1
FMU-CH1  (via drill 0.3 pad 0.55)
  Top 0.2: v39.36,18.96 39.16,19.16 39.05,19.16 38.76,19.46 v38.76,20.66 | v35.96,13.76 36.51,13.76 U101.45
  Horizontal 0.2: v38.96,32.36 34.26,32.36 33.76,31.86 12.36,31.86 v11.56,31.06
  Vertical 0.2: v38.76,20.66 37.96,21.46 37.96,24.36 38.96,25.36 v38.96,32.36 | v11.56,31.06 11.56,28.86 v11.48,28.85
  Bottom 0.2: v35.96,13.76 36.46,13.76 39.26,16.56 39.26,18.86 v39.36,18.96
  Bottom 0.254: L1001.P$1 v11.48,28.85
FMU-CH1-PROT
  Bottom 0.2: J1001.S1 7.01,28.45 9.35,28.45 9.55,28.24 10.05,28.24 L1001.P$16
FMU-CH2  (via drill 0.3 pad 0.55)
  Top 0.2: v34.36,15.46 33.96,15.06 33.96,13.36 34.66,12.66 35.05,12.66 35.55,13.16 36.4,13.16 U101.44 36.86,12.66
  Ground 0.2: v34.36,15.46 34.36,15.86 33.66,16.56 31.46,16.56 28.16,19.86 27.05,19.86 v26.96,19.96
  Horizontal 0.2: v13.96,28.76 12.46,28.76 12.26,28.56 v12.19,28.55
  Vertical 0.2: v25.16,28.36 25.66,28.36 26.66,27.36 26.66,20.26 v26.96,19.96
  Bottom 0.2: v25.16,28.36 24.86,28.66 20.95,28.66 20.16,27.86 14.86,27.86 v13.96,28.76
  Bottom 0.254: L1001.P$2 12.02,27.77 12.19,27.94 v12.19,28.55
FMU-CH3  (via drill 0.3 pad 0.55)
  Top 0.2: 36.26,11.86 U101.42 37.09,11.06 v37.16,11.06
  Horizontal 0.2: v12.8,28.14 12.86,28.16 14.15,28.16 14.56,28.56 14.56,28.66 15.06,29.16 18.05,29.16 19.16,30.26 31.36,30.26 32.66,28.96 v33.66,28.96
  Vertical 0.2: v37.16,11.06 37.16,16.46 35.66,17.96 35.66,25.96 34.96,26.66 34.96,28.46 34.46,28.96 v33.66,28.96
  Bottom 0.254: L1001.P$3 12.23,27.27 12.8,27.84 v12.8,28.14
FMU-CH4  (via drill 0.3 pad 0.55)
  Top 0.2: v29.05,13.76 29.26,13.76 29.66,14.16 30.16,14.16 30.86,13.46 33.27,13.46 U101.40 35.46,11.26
  Horizontal 0.2: v30.96,21.36 30.96,21.66 29.86,22.76 18.16,22.76 17.55,22.16 13.26,22.16 12.65,22.76 12.65,26.86 13.15,27.36 v13.21,27.43
  Vertical 0.2: v29.05,13.76 29.26,13.76 31.36,15.86 31.36,20.16 31.55,20.36 31.55,20.76 v30.96,21.36
  Bottom 0.254: L1001.P$4 12.54,26.77 v13.21,27.43
FMU-CH5  (via drill 0.3 pad 0.55)
  Top 0.2: 35.86,20.66 U101.60 34.96,19.83 v34.96,19.36
  Horizontal 0.2: v14.76,25.96 14.96,25.76 16.16,25.76 16.76,25.16 23.76,25.16 23.96,24.96 24.55,24.96 24.76,24.76 29.55,24.76 29.66,24.86 v30.05,24.86
  Vertical 0.2: v30.05,24.86 30.86,24.86 34.96,20.76 v34.96,19.36
  Bottom 0.2: v14.76,25.96 14.26,25.96 13.65,26.56 13.26,26.56 13.21,26.62
  Bottom 0.254: L1001.P$5 12.86,26.27 13.21,26.62
FMU-CH6  (via drill 0.3, 0.3 pad 0.55)
  Top 0.2: v13.96,27.06 13.96,26.56 13.36,25.96 v13.31,25.91 | U101.62 35.26,21.56 37.05,23.36 v39.05,23.36
  Horizontal 0.2: v13.96,27.06 14.46,27.56 19.55,27.56 20.26,26.86 22.45,26.86 22.96,27.36 33.36,27.36 33.55,27.16 37.86,27.16 38.05,27.36 38.96,27.36 39.36,27.76 40.16,27.76 40.46,28.06 v40.46,28.76
  Vertical 0.2: v39.05,23.36 38.86,23.56 38.86,24.36 39.46,24.96 39.46,27.06 40.46,28.06 v40.46,28.76
  Bottom 0.254: L1001.P$6 13.17,25.77 v13.31,25.91
FMU-CH7  (via drill 0.3 pad 0.55)
  Top 0.2: v25.96,3.16 26.36,3.16 26.66,3.46 26.66,5.86 27.36,6.56 U101.24
  Vertical 0.2: v17.76,23.16 20.95,23.16 21.55,22.56 21.55,20.16 22.76,18.96 22.76,18.46 22.26,17.96 22.26,17.46 22.55,17.16 22.55,16.86 23.05,16.36 23.05,8.86 25.96,5.96 v25.96,3.16
  Bottom 0.2: v17.76,23.16 17.26,23.16 15.96,24.46 15.86,24.46 14.96,25.36 13.86,25.36 v13.82,25.4
  Bottom 0.254: L1001.P$7 13.69,25.27 v13.82,25.4
FMU-CH8  (via drill 0.3, 0.3 pad 0.55)
  Top 0.2: v34.36,19.96 35.46,21.06 U101.61
  Horizontal 0.2: v34.36,19.96 33.16,19.96 29.96,23.16 25.05,23.16 24.86,23.36 23.76,23.36 22.55,24.56 14.46,24.56 14.26,24.76 v14.22,24.79
  Vertical 0.254: v10.46,10.06 10.46,12.16 9.86,12.76 9.26,12.76 8.56,13.46 8.56,19.86 11.65,22.96 11.65,23.56 12.89,24.79 v14.22,24.79
  Bottom 0.254: L1001.P$8 14.2,24.77 v14.22,24.79 | JP202.2 10.96,11.56 10.46,11.06 v10.46,10.06
FMU-CH9
  Top 0.254: U101.25 27.16,5.66 27.16,5.26 27.36,5.06 R1001.P$2
FMU-CH10
  Top 0.254: U101.26 31.16,5.67 31.16,5.06 31.05,4.96 R1002.P$2
FMU-I2C1_SCL  (via drill 0.3 pad 0.55)  (1 unrouted)
  Top 0.2: v37.36,22.76 39.96,22.76 40.03,22.86 | v32.96,21.16 32.96,20.96 v31.96,19.96 | v22.16,18.76 21.61,18.76 U101.95
  Top 0.305: R402.P$1 40.23,21.85 40.23,22.66 40.03,22.86
  Horizontal 0.2: v31.96,19.96 30.96,18.96 22.36,18.96 v22.16,18.76
  Bottom 0.2: v37.36,22.76 34.86,22.76 33.86,21.76 33.55,21.76 v32.96,21.16
  Bottom 0.254: v40.03,23.36 40.03,22.59 L402.P$8
FMU-I2C1_SDA  (via drill 0.3 pad 0.55)
  Top 0.2: U101.96 21.5,18.16 v21.55,18.16
  Top 0.254: R404.P$1 39.83,20.73 39.62,20.93 39.62,21.74 v39.32,22.05
  Horizontal 0.2: v36.96,17.56 36.55,17.56 36.36,17.76 25.76,17.76 24.96,18.56 22.76,18.56 22.36,18.16 v21.55,18.16
  Bottom 0.2: v36.96,17.56 38.16,18.76 38.16,21.56 38.66,22.06 39.36,22.06 v39.32,22.05
  Bottom 0.254: v39.32,22.05 39.35,22.08 L402.P$7
FMU-I2C2_SCL  (via drill 0.3 pad 0.55)
  Top 0.2: v38.16,16.26 38.16,15.96 37.26,15.06 37.26,14.42 U101.47 37.96,13.76
  Top 0.254: L402.P$2 39.45,19.58 v39.32,19.71
  Top 0.305: R401.P$1 40.52,19.58 L402.P$2
  Bottom 0.2: v38.16,16.26 38.55,16.66 38.55,19.46 38.66,19.56 39.36,19.56 v39.32,19.71
  Bottom 0.254: v39.32,19.71 39.45,19.58 L402.P$2
FMU-I2C2_SDA  (via drill 0.3 pad 0.55)
  Top 0.2: R403.P$1 40.66,18.56 40.66,17.46 40.46,17.26 39.96,17.26 37.76,15.06 37.76,14.63 U101.48
  Top 0.254: R403.P$1 v39.93,18.49
  Bottom 0.254: v39.93,18.49 40.04,18.6 L402.P$1
FMU-SWCLK  (via drill 0.3 pad 0.55)
  Top 0.2: v28.86,18.36 28.05,19.16 28.05,22.26 28.36,22.56 28.36,25.46 27.86,25.96 27.84,25.96 U101.76
  Bottom 0.2: v28.86,18.36 28.36,17.86 27.05,17.86 JX301.4
FMU-SWDIO  (via drill 0.3 pad 0.55)
  Top 0.2: 31.55,24.96 U101.72 28.7,22.06 v28.66,22.06
  Bottom 0.2: v28.66,22.06 28.66,19.36 28.36,19.06 27.05,19.06 JX301.2
FMU-SWO  (via drill 0.3 pad 0.55)
  Top 0.2: U101.89 23.95,20.66 v24.05,20.66
  Bottom 0.2: v24.05,20.66 24.05,19.46 25.16,18.36 25.16,16.76 25.36,16.56 26.96,16.56 JX301.6
FMU-UART7_RX  (via drill 0.3 pad 0.55)
  Top 0.2: v30.46,12.06 33.26,12.06 U101.38
  Horizontal 0.2: v30.46,12.06 30.46,11.36 29.46,10.36 28.96,10.36 27.55,8.96 19.86,8.96 18.55,10.26 18.38,10.26 v17.68,9.55
  Bottom 0.254: L202.P$5 17.52,9.4 v17.68,9.55
FMU-UART7_TX  (via drill 0.3, 0.3 pad 0.55)
  Top 0.2: v29.46,13.16 30.16,13.16 30.86,12.46 33.57,12.46 U101.39 35.16,10.86
  Horizontal 0.2: v29.46,8.46 28.66,8.46 28.55,8.36 27.55,8.36 27.36,8.56 18.79,8.56 18.45,8.9 v18.45,9.56
  Vertical 0.2: v29.46,8.46 v29.46,13.16
  Bottom 0.2: L202.P$7 18.52,9.49 v18.45,9.56
FMU-UART8_RX  (via drill 0.3)
  Top 0.2: v21.55,17.36 20.95,17.96 20.95,17.99 U101.97
  Vertical 0.2: v16.36,10.96 16.36,13.86 17.05,14.56 18.76,14.56 19.36,15.16 19.36,15.96 19.76,16.36 19.76,17.36 20.16,17.76 21.16,17.76 v21.55,17.36
  Bottom 0.2: U$202.6 12.4,10.01 12.96,10.56 13.65,10.56 14.06,10.96 v16.36,10.96
FMU-UART8_TX  (via drill 0.3)
  Top 0.2: U101.98 19.36,18.89 19.36,19.26
  Top 0.254: 19.36,19.26 19.76,19.66 v19.76,20.96
  Vertical 0.254: v19.76,20.96 19.76,19.66 18.45,18.36 17.05,18.36 16.16,19.26 12.96,19.26 12.06,18.36 12.06,10.16 13.15,9.06 v14.56,9.06
  Bottom 0.254: U$202.3 14.21,8.71 v14.56,9.06
FMU-USART2_CTS  (via drill 0.3 pad 0.55)
  Top 0.2: v25.55,11.36 25.55,22.59 U101.84 24.96,23.26
  Bottom 0.2: v25.55,11.36 25.55,10.76 L201.P$8
FMU-USART2_RTS  (via drill 0.3 pad 0.55)
  Top 0.2: v24.86,12.56 25.16,12.86 25.16,15.46 23.86,16.76 23.86,19.66 25.16,20.96 25.16,22.28 U101.85
  Bottom 0.2: v24.86,12.56 24.86,10.56 25.22,10.19 L201.P$7
FMU-USART2_RX  (via drill 0.3 pad 0.55)
  Top 0.2: v24.55,21.16 24.55,21.47 U101.87
  Vertical 0.2: v24.55,16.86 25.05,17.36 25.05,18.76 24.36,19.46 24.36,20.16 24.66,20.46 24.66,21.06 v24.55,21.16
  Bottom 0.2: v24.55,16.86 24.26,16.86 23.05,15.66 23.05,11.96 24.05,10.96 24.05,9.56 24.42,9.19 L201.P$5 25.55,9.16
FMU-USART2_TX  (via drill 0.3 pad 0.55)
  Top 0.2: v23.96,23.96 23.66,23.66 23.66,22.96 24.05,22.56 24.16,22.56 U101.86 | v23.05,19.66 23.05,19.36 23.46,18.96 23.46,16.66 24.46,15.66 v24.46,13.16
  Bottom 0.2: v23.96,23.96 23.96,21.86 23.05,20.96 v23.05,19.66 | v24.46,13.16 24.46,12.96 24.26,12.76 24.26,11.26 24.46,11.06 24.46,9.86 24.62,9.69 L201.P$6
FMU-USART3_CTS  (via drill 0.3 pad 0.55)
  Top 0.2: 36.66,20.06 U101.58 37.3,20.76 v37.55,20.76
  Horizontal 0.2: v19.45,10.66 19.66,10.86 21.55,10.86 21.66,10.96 25.16,10.96 25.36,10.76 26.86,10.76 v27.76,11.66
  Bottom 0.2: v19.45,10.66 20.36,9.76 22.36,9.76 24.42,7.69 L201.P$2 25.55,7.66 | v27.76,11.66 27.96,11.46 28.55,11.46 30.16,13.06 32.76,13.06 36.05,16.36 36.05,19.26 v37.55,20.76
FMU-USART3_RTS  (via drill 0.3 pad 0.55)
  Top 0.2: v32.96,17.16 33.76,17.96 34.46,17.96 35.55,19.06 35.55,19.72 U101.59 36.26,20.46
  Horizontal 0.2: v32.96,17.16 32.76,17.36 25.86,17.36 24.66,16.16 21.86,16.16 v21.55,16.46
  Vertical 0.2: v21.55,16.46 21.26,16.56 20.86,16.56 20.45,16.16 20.45,15.56 20.16,15.26 20.16,13.16 v19.26,12.26
  Bottom 0.2: v19.26,12.26 19.05,12.06 18.66,12.06 18.45,11.86 18.45,10.86 19.26,10.06 19.55,10.06 20.26,9.36 22.26,9.36 24.42,7.19 L201.P$1 25.55,7.16
FMU-USART3_RX  (via drill 0.3 pad 0.55)
  Top 0.2: v33.16,15.96 35.86,18.66 36.66,18.66 37.26,19.26 U101.56
  Horizontal 0.2: v21.05,15.96 21.26,15.76 32.55,15.76 32.76,15.96 v33.16,15.96
  Bottom 0.2: v21.05,15.96 20.76,15.66 20.55,15.66 20.16,15.26 20.16,14.86 22.26,12.76 22.26,11.76 23.26,10.76 23.26,9.36 24.42,8.19 L201.P$3 25.55,8.16
FMU-USART3_TX  (via drill 0.3 pad 0.55)
  Top 0.2: v29.26,14.56 32.66,14.56 36.36,18.26 36.92,18.26 U101.55
  Horizontal 0.2: v22.45,14.56 23.86,14.56 24.05,14.76 28.46,14.76 28.66,14.56 v29.26,14.56
  Bottom 0.2: v22.45,14.56 22.66,14.36 22.66,11.86 23.66,10.86 23.66,9.46 24.42,8.69 L201.P$4 25.55,8.66
FMU-VDD_3V3  (via drill 0.3, 0.3 pad 0.3, 0.3 pad 0.55)
  Top 0.2: 29.16,25.36 29.66,25.36 29.76,25.46 29.98,25.46 U101.75 | 39.16,15.56 v39.13,15.56 v39.12,15.55
  Top 0.254: U101.21 U101.22 28.01,8.64 28.04,8.64 | C717.P$1 25.91,6.51 25.91,6.6 25.71,6.81 25.71,7.04 U101.21 | U402.3 25.01,32.19 25.2,32 C402.P$1 | U401.3 14.24,32.19 14.53,31.9 14.53,31.29 14.63,31.19 C401.P$1 | U$701.7 16.27,15.69 C705.P$1 16.87,16.09 16.93,16.15 | v18.8,16.97 19.26,17.43 U101.100 18.59,18.24 | U101.75 30.57,26.22 C711.P$1 | v23.67,12.09 v23.67,12.08 U101.11 21.95,10.36 v21.84,10.36 21.74,10.46 21.34,10.46 C715.P$1 | C710.P$1 32.56,6.05 32.21,6.4 31.84,6.4 U101.28 30.41,7.83 v30.17,8.33 | U101.21 27.64,8.97 27.71,8.97 | 27.71,8.97 28.04,8.64 | 27.71,8.97 27.03,9.65 26.9,9.65 U101.19 | 28.04,8.64 v28.35,8.94 | v42.26,12.26 42.26,11.56 42.36,11.46 43.16,11.46 R702.P$1
  Top 0.3: 18.59,18.24 18.17,18.66 v18.16,19.06 18.69,19.59 C713.P$1
  Top 0.305: U101.50 39.33,14.74 C712.P$1 v39.43,15.95 v39.42,15.95 | C706.P$1 20.14,9.96 20.22,9.96 20.42,9.75 20.62,9.75 C715.P$1 | 43.89,21.44 43.89,20.94 C302.P$1 | 41.25,22.66 R402.P$2 R404.P$2 41.24,20.33 41.55,20.02 R401.P$2 41.55,19.06 41.66,18.96 R403.P$2 | C717.P$1 25.76,5.94 25.76,4.76 25.51,4.51 D701.ANODE
  Top 0.406: 16.93,16.15 17.48,16.15 17.68,16.36 18.19,16.36 v18.8,16.97 | v18.8,16.15 v18.8,16.97 | v19.2,16.56 18.9,16.87 v18.8,16.97 | C711.P$1 29.57,27.23 v29.57,27.94 v28.96,27.94 28.96,27.84 26.32,27.84 25.91,28.24 25.91,29.26 25.71,29.46 25.6,29.46 25.2,29.87 C402.P$1 | C301.P$1 43.85,21.48 43.89,21.44 | U$801.C 14.64,29.87 | 14.64,29.87 C401.P$1 | v13.21,29.87 v13.82,29.87 14.64,29.87 | 39.16,15.56 39.36,15.56 39.66,15.26 | 30.16,8.96 30.16,8.35 v30.17,8.33 | 41.05,22.66 40.96,22.74 U$302.8 39.59,24.19 v39.46,24.06 40.05,24.06
  Top 0.61: C301.P$1 42.67,22.25 42.27,22.66 41.25,22.66 41.05,22.66 | v31.6,34.24 v30.89,34.24 30.79,34.24 30.48,33.93 30.48,30.58 29.37,29.47 29.37,28.25 29.46,28.06 v29.57,27.94
  Vertical 0.254: v10.15,7.36 10.15,7.96 10.56,8.36 10.96,8.36 11.46,8.86 11.46,18.46 12.86,19.86 14.86,19.86 15.06,20.06 16.26,20.06 17.26,19.06 v18.16,19.06
  Power 0.254: 39.91,14.61 v42.26,12.26
  Power 0.305: v39.42,15.95 39.12,15.95
  Power 0.406: v18.8,16.97 v18.8,16.15 | 28.65,34.24 28.55,34.34 27.23,34.34 27.13,34.24
  Power 0.61: v31.6,34.24 v30.89,34.24 28.65,34.24 | 27.13,34.24 18.81,34.24 14.44,29.87 v13.82,29.87 v13.21,29.87
  Bottom 0.22: U$202.5 12.56,9.36 12.76,9.16
  Bottom 0.254: 20.05,25.56 J801.P$1 | v32.96,19.06 31.16,19.06 JX301.1 | 12.76,9.16 12.76,8.36 12.56,8.16 | 12.56,8.16 10.56,8.16 10.15,7.76 v10.15,7.36 | 12.56,8.16 v12.56,7.66
  Bottom 0.3: C201.P$1 v10.15,7.36 | v18.16,19.06 17.45,19.76 17.45,21.96 20.05,24.55 J801.P$1
  other vias: 40.04,24.08 29.16,25.34 28.85,9.44 30.17,8.93
  pour Power: 18.59,14.33 18.59,17.88 28.86,28.14 29.56,28.14 34.05,23.66 37.36,23.66 37.96,24.26 40.36,24.26 40.76,23.86 40.76,21.86 38.55,19.66 38.55,18.96 42.73,14.97 42.63,11.34 36.55,11.26 30.89,5.59 27.43,5.59 24.86,8.16 22.26,8.16 20.95,9.46 21.03,11.99 20.93,11.99
  pour Top: 27.55,7.96 29.16,9.56 28.86,9.86 28.55,9.86 28.26,9.56 26.76,9.56 26.36,9.16
FMU_AUX_ADC1
  Top 0.2: 28.96,6.86 28.46,7.36 28.46,8.26 29.46,9.26 29.46,9.76 29.05,10.16 28.46,10.16 28.16,9.86 27.46,9.86 27.26,10.06 26.76,10.06 26.36,9.66 26.2,9.66 U101.18
  Top 0.254: 28.96,6.86 28.96,6.06 28.86,5.96 R405.P$1
FMU_AUX_ADC1_PROT  (via drill 0.3)
  Top 0.2: 34.55,3.56 34.86,3.26 C403.P$1
  Top 0.254: 34.55,3.56 v33.36,3.56 | v29.96,3.16 29.64,3.47 R405.P$2
  Top 0.305: C403.P$1 36.06,2.75 36.36,2.46 J$401.2
  Horizontal 0.254: v33.36,3.56 30.36,3.56 v29.96,3.16
FMU_AUX_ADC2
  Top 0.2: 33.05,8.76 U101.33 33.76,8.02 33.76,5.16 33.6,5 R406.P$1
FMU_AUX_ADC2_PROT
  Top 0.2: J$401.1 38.9,2.82 38.86,2.86 38.22,2.86 C404.P$1 37.79,2.92 37.26,3.46 35.26,3.46 34.6,4.11 R406.P$2
GND  (via drill 0.3, 0.3 pad 0.55)  (2 unrouted)
  Top 0.254: U101.20 24.84,6.89 C717.P$2 | U402.2 25.12,32.84 | 25.12,32.84 25.71,33.43 26.52,33.43 U402.8 | 25.12,32.84 25.6,32.35 25.6,31.8 25.87,31.54 U402.5 26.58,31.15 26.42,30.99 26.32,30.99 26.21,30.89 C402.P$2 | C401.P$2 15.65,30.39 15.65,30.89 15.91,31.15 U401.5 15.1,31.54 14.94,31.7 14.94,32.21 14.73,32.41 14.73,32.55 14.45,32.84 | U401.2 14.45,32.84 | 14.45,32.84 15.1,33.49 U401.8 | U$601.6 9.46,21.22 9.15,21.54 9.15,24.05 C601.2 10.06,24.28 10.47,24.7 C602.P$2 | U$601.9 9.66,20.02 9.25,19.61 9.25,16.23 C605.2 | U$601.4 11.08,22.75 v10.67,23.16 | C102.P$1 23.57,7.01 23.57,6.66 | 23.57,6.66 23.57,6.2 22.05,4.67 21.84,4.67 21.28,5.24 X101.4 21.08,5.18 20.83,5.18 20.32,5.69 20.12,5.69 19.91,5.49 19.51,5.49 18.29,6.71 18.29,7.01 19.91,8.64 20.12,8.64 20.76,8 X101.2 20.79,8.49 C101.P$2 | U$701.2 14.73,15.69 U$701.GND | 18.59,15.04 18.49,14.93 18.49,14.63 18.4,14.54 C703.P$1 17.93,14.59 | U101.74 31.6,26.37 31.6,26.72 30.74,27.58 C711.P$2 30.63,27.73 | U$703.P$3 14.88,12.25 U$703.6 16.01,12.25 R704.P$2 | U$703.2 14.58,12.75 U$703.P$2 | U$501.10 42.98,6.51 C503.P$2 | C604.P$2 11.08,18.19 U$601.11 U$601.19 | 21.44,10.97 21.86,10.97 U101.10 | v29.87,7.52 30.02,7.52 U101.27 31.6,5.94 31.6,5.49 C710.P$2 31.85,5.16 32.26,4.76 32.26,3.56 33.05,2.76 | U$702.GND 44.96,14.58 U$702.2 44.96,16.31 44.91,16.36 C702.P$2 44.1,16.36 43.38,17.07 43.38,17.67 R805.P$1 | U101.99 20.47,17.07 | 11.65,20.86 11.46,20.66 | v15.96,25.16 17.45,25.16 R802.P$2 | 20.38,10.93 20.36,10.96 C715.P$2 | 38.55,10.36 C501.P$2 36.58,10.16 R101.P$2 | 23.57,6.66 23.55,6.66 23.74,6.84 | v16.95,31.26 16.95,31.36 16.76,31.56 15.96,31.56
  Top 0.254: 37.96,30.56 37.8,30.72 U$301.2 | v36.36,6.06 36.4,6.01 U$501.5
  Top 0.3: 13.46,32.86 12.26,32.86 11.86,33.26 v11.86,34.26 | U$601.EP1 11.46,20.62 11.46,20.66
  Top 0.305: C712.P$2 40.69,16.05 C716.P$2 | C715.P$2 20.38,10.93 20.73,11.28 | C707.P$2 46.74,14.53 46.53,14.33 U$702.GND 43.79,14.33 43.6,14.13 R703.P$1 | U402.2 23.19,32.84 22.96,32.61 | v15.24,28.55 15.44,28.75 15.44,28.85 15.64,29.05 U$801.A | 26.55,31.56 27.36,31.56 27.66,31.26 v27.66,31.29 | 18.6,22.01 v18.66,21.96 | v39.62,31.25 39.35,31.25 38.66,30.56 37.96,30.56 | C404.P$2 38.89,3.92 v39.05,3.76 | J$401.3 33.82,2.71 C403.P$2 v33.08,2.75 v33.08,2.74 | 44.72,20.22 44.86,20.36 44.86,20.96
  Top 0.406: C102.P$1 C717.P$2 | 18.59,15.04 18.85,15.29 | 18.85,15.29 19.41,15.85 19.51,15.95 19.92,16.36 20.12,16.56 20.52,16.97 | C706.P$2 18.98,11.48 v19,11.48 v19.61,11.48 C715.P$2 | C712.P$2 41.05,16.46 v41.05,16.56 | C716.P$2 42.27,15.65 v42.27,16.56 | 9.15,10.29 C606.2 | 8.97,10.06 C606.2 | v18.8,15.44 18.8,15.34 18.85,15.29 | v9.85,14.63 9.25,14.53 v9.25,14.63 | 20.73,11.28 20.93,11.28 21.23,10.97 21.44,10.97 | 45.42,21.64 45.42,21.03 45.31,20.93 C302.P$2 | 45.42,21.64 45.42,22.19 C301.P$2 | L404.P$5 43.08,20.42 43.29,20.22 44.72,20.22 | v46.15,21.74 45.84,21.44 45.62,21.44 45.42,21.64 | U$701.GND U$703.P$2 | U$703.P$2 U$703.P$3 | U$703.P$2 14.73,13.61 v14.83,13.72 | 46.74,14.53 46.94,14.33 47.35,14.33 47.59,14.08 C709.P$2 47.59,10.11 47.23,9.75 44.6,9.75 L403.P$5 43.38,9.45 C502.P$2 | R708.P$2 8.95,8.75 9.15,8.94 9.15,10.24 C606.2 | C715.P$2 | 20.47,17.07 20.52,16.97 | 20.52,16.97 v20.52,17.07 | U$801.A C401.P$2 | D901.2 19.41,4.06 20.52,2.95 20.52,1.63 R903.P$1 20.89,1.52 21.05,1.36 v21.05,0.76 | C714.P$1 7.93,33.11 v7.82,33.12 | 30.96,28.16 31.37,28.57 C718.P$2 31.47,28.63 32.72,29.87 L406.P$5 | 30.96,28.16 30.86,28.16 30.66,28.36 30.66,28.66 30.16,29.16 | C711.P$2 30.96,27.91 30.96,28.16 | C704.P$2 45.15,11.49 v45.26,11.38 | C713.P$2 18.69,21.92 v18.66,21.96 | 18.6,22.01 18.67,22.07 R709.P$1 | v38.76,11.86 38.76,11.26 38.55,11.06 38.55,10.18 C501.P$2 | v25.16,0.86 25.66,1.36 JP702.P$1 | 29.86,7.56 29.66,7.76 29.36,7.76 29.36,7.73 v29.37,7.72 | 10.96,18.06 9.65,18.06 | U$302.4 46.21,28.4 45.76,28.86 43.7,28.86 v43.69,28.84 | C503.P$2 44.01,6.71 44.16,6.86 44.16,7.36 44.16,7.37 v44.19,7.41
  Top 0.61: v23.37,7.21 23.74,6.84 v23.78,6.81 | C605.2 C607.2 | 10.67,23.37 10.67,23.67 | 10.67,23.67 v10.87,23.88 | 10.67,23.67 10.47,23.67 | v14.83,13.72 14.73,13.72 v14.33,14.12 | 44.71,8.12 44.71,9.25 44.6,9.75 | 22.96,32.61 22.96,31.39 v22.56,30.99 v21.95,30.99 | 44.16,7.36 44.55,7.36 44.66,7.46 44.66,8.06 44.76,8.16
  Ground 0.406: v44.19,7.41 43.69,6.71 | v28.55,28.55 28.75,28.55
  Bottom 0.2: L202.P$1 15.52,7.39 15.56,7.36 | L202.P$15 L202.P$2
  Bottom 0.254: L204.P$4 24.09,5.49 v23.98,5.38 | L205.P$3 12.56,5.46 12.56,5.38 | L203.P$4 37.36,2.16 37.29,2.16 | L403.P$4 44.05,9.76 43.76,9.76 L403.P$5 | L401.P$3 37.05,23.96 36.98,23.96 | C603.P$2 11.96,18.76 11.96,19.96 12.06,20.06 U$601.22 | 31.16,16.56 JX301.5 31.05,16.56 v29.26,16.56 | 31.16,17.86 JX301.3 | L405.P$4 20.05,29.46 19.76,29.46 L405.P$5 19.66,29.46 19.45,29.46 L405.P$3 | L204.P$5 25.05,5.46 25.36,5.46 L204.P$3 25.81,5.49 26.27,5.02 J202.P$6 26.36,5.06 26.36,8.86 L201.P$EP | v39.05,3.76 37.76,3.76 J201.P$6 | v32.96,14.06 31.16,14.06 JX301.9 | L402.P$EP 40.66,20.76 40.66,16.96 40.96,16.66 v41.05,16.56 | U$202.2 14.06,9.36 14.36,9.66 | L404.P$4 L404.P$5 | 46.16,21.76 46.15,21.76 v46.15,21.74 | L401.P$4 37.05,24.76 37.16,24.66 37.05,24.56 L401.P$5
  Bottom 0.305: L203.P$5 37.29,2.16 L203.P$4 37.29,1.41 U$203.A | L203.P$3 37.29,3.38 J201.P$6 | L405.P$3 18.49,29.46 18.39,29.36 18.39,29.84 J404.P$4 | L405.P$4 20.63,29.46 U$403.A | U$401.A U$402.A 43.88,19 43.28,19 43.08,19.2 L404.P$4 | U$204.A | L205.P$4 11.38,5.38 11.08,5.68 U$205.A | L1001.P$EP 10.77,23.98 v10.87,23.88 | 31.16,17.86 29.55,17.86 29.26,17.56 v29.26,16.56 | R701.P$1 15.65,15.52 15.65,15.56 | J301.P$4 39.67,31.2 v39.62,31.25
  Bottom 0.406: L205.P$4 L205.P$5 L205.P$3 12.56,5.38 13.02,5.38 13.31,5.09 | 13.31,5.09 J203.P$6 | L403.P$3 43.08,9.75 42.88,9.96 42.88,11.58 43.44,11.58 J402.P$4 45,11.64 v45.26,11.38 | L404.P$3 43.08,21.68 J403.P$4 43.5,22.06 45.05,22.06 45.36,21.76 46.16,21.76 | U$404.A 22.16,29.57 21.84,29.26 20.84,29.26 U$403.A | J405.P$4 29.06,29.84 29.06,29.57 | J405.P$4 29.1,28.9 28.75,28.55 v28.55,28.55 | 13.31,5.09 13.31,6.2 13.81,6.7 | 36.78,23.47 36.98,23.67 36.98,23.96 L401.P$3 L401.P$5 | S701.B3 7.61,33.34 v7.82,33.12 | v23.98,5.38 24.17,5.19 U$204.A | v17.76,28.46 17.76,28.56 18.36,29.16 | 29.16,30.16 29.05,30.06 29.16,29.96 | 27.66,31.26 27.86,31.46 28.76,31.46 29.16,31.06 29.16,29.96 | J405.P$4 29.16,29.94 29.16,29.96
  Bottom 0.61: J401.P$7 33.43,23.47 35.87,23.47 36.27,23.47 36.78,23.47
  other vias: 15.55,18.38 17.37,13.92 9.65,18.19 9.56,22.78 9.95,22.34 9.55,21.93 9.55,19.56 9.14,11.78 9.75,11.79 9.65,17.58 30.59,28.74 44.3,28.84 19.77,3.51 14.76,16.56 45.96,14.36 13.95,20.56 21.76,29.36 13.86,6.76 10.25,13.24 15.06,9.56 30.19,29.14 21.95,26.36
  pour Ground (no thermals): -9.24,-2.72 arc90 -9.22,-2.74
  pour Top: 8.43,23.27 9.65,23.27 9.96,23.57 10.57,23.57 10.67,23.47 10.67,23.06 10.36,22.76 10.16,22.76 8.64,23.06
  pour Top (no thermals): 14.41,13.39 14.21,13.6 14.06,13.66 14.06,14.26 14.46,14.26 14.46,16.86 14.81,17.15 14.92,17.37 14.92,17.98 15.13,18.18 15.25,18.28 15.26,18.36 15.36,18.46 15.76,18.46 15.94,18.28 16.05,18.28 16.05,17.65 15.06,16.66 15.06,11.46 15.05,11.38 15.45,11.38 15.45,11.06 15.46,10.86 13.96,10.86 13.96,11.36 14.42,11.38
  pour Top: 13.31,21.24 13.82,21.24 14.12,20.93 17.48,20.93 17.48,20.02 13.31,20.02
  pour Ground (no thermals): 9.86,0.2 9.86,5.59 7.93,7.52 7.93,29.06 6.3,30.68 6.3,34.44 6.71,34.85 42.57,34.75 42.57,31.39 45.01,28.96 48.46,28.96 48.46,5.79 44.81,5.79 42.77,3.76 42.77,0.3 42.57,0.1 9.96,0.1
  pour Ground: 9.86,0.4 6.81,0.4 6.1,1.12 6.1,5.08 5.28,5.89 0.71,5.89 0.2,6.4 0.2,28.85 0.71,29.36 7.72,29.36 8.03,29.06 8.03,7.52 9.86,5.69
  pour Top: 8.13,10.15 9.96,10.15 10.46,10.66 10.46,15.76 10.16,16.05 10.16,19.51 9.86,19.81 9.86,22.05 10.97,23.16 10.97,25.5 10.67,25.81 8.84,25.81 8.13,25.1
  pour Bottom (no thermals): 1.25,29.06 2.09,29.06 2.09,10.06 2.08,9.55 1.26,9.55 1.25,9.95
  pour Bottom (no thermals): 9.36,23.06 9.65,23.36 12.15,23.36 14.06,21.46 15.86,21.46 15.86,19.46 11.46,19.46 11.46,18.06 11.56,17.96 14.65,17.96 15.26,18.56 15.86,18.56 15.86,10.86 11.46,10.86 11.46,8.16 8.96,8.06 8.06,8.86 8.06,12.76 9.06,13.76 9.06,15.86 9.36,16.16
  pour Bottom: 10.06,3.86 10.06,5.66 11.06,5.66 11.06,6.76 12.26,7.96 12.26,9.56 5.96,9.56 5.16,8.76 3.46,8.76 2.66,9.56 0.66,9.56 0.66,6.16 1.16,5.66 4.36,5.66 5.56,4.46 5.56,3.86
  pour Top (no thermals): 1.25,29.06 2.09,29.06 2.09,10.06 2.08,9.55 1.26,9.55 1.25,9.95
  pour Bottom: 13.56,6.56 13.56,10.46 16.26,10.46 16.26,6.56
  pour Bottom: 11.56,19.66 15.86,19.66 15.86,17.76 11.56,17.76
  pour Top: 16.36,14.66 17.95,14.66 18.16,14.96 18.55,14.96 18.55,14.56 17.86,13.86 16.66,13.86 16.36,14.16
  cutout Vertical: 4.06,29.16 6.06,31.16 6.06,34.56 42.96,34.56 42.96,30.96 44.66,29.26 48.05,29.26 48.05,5.76 44.55,5.76 42.76,3.96 42.76,0.56 5.66,0.56 5.66,4.26 4.16,5.76 0.56,5.76 0.56,29.16
  cutout Horizontal: 4.06,29.16 6.06,31.16 6.06,34.56 42.96,34.56 42.96,30.96 44.66,29.26 48.05,29.26 48.05,5.76 44.55,5.76 42.76,3.96 42.76,0.56 5.66,0.56 5.66,4.26 4.16,5.76 0.56,5.76 0.56,29.16
  pour Top: 36.46,32.06 41.86,32.06 44.55,29.36 47.55,29.36 48.05,28.86 48.05,9.36 42.86,9.36 42.86,13.86 40.46,16.16 40.46,16.26 41.26,17.06 41.16,23.86 36.46,23.86
GPIO_EXT_1  (via drill 0.3 pad 0.55)
  Top 0.2: v31.96,21.96 31.96,20.76 30.26,19.06 30.26,16.76 27.16,13.66 27.16,12.66 26.76,12.26 26.76,11.76 25.76,10.76 25.36,10.76 24.26,11.86 24.26,12.26 23.86,12.66 23.46,12.66 23.26,12.86 22.33,12.86 U101.8
  Bottom 0.2: v31.96,21.96 32.16,22.16 32.16,23.46 J401.P$6
GYRO_DRDY  (via drill 0.3 pad 0.55)
  Top 0.2: v36.36,7.26 35.94,7.26 U101.35
  Top 0.305: U$501.9 42.25,6.01 v42.37,5.89
  Horizontal 0.2: v36.36,7.26 37.66,5.96 42.36,5.96 v42.37,5.89
MAG_DRDY  (via drill 0.3)
  Top 0.2: U$501.12 40.11,7.51 v40.05,7.46 | v36.05,8.46 35.86,8.26 35.55,8.26 34.76,9.06 34.76,9.14 U101.36
  Horizontal 0.2: v40.05,7.46 37.05,7.46 v36.05,8.46
N$1
  Top 0.2: X101.1 22.26,6.46 22.16,6.46 21.76,6.86 22.45,7.56 22.55,7.46 23.36,8.26 C102.P$2
  Top 0.245: U101.13 22.86,9.85 22.86,9.65 23.67,8.84 23.67,8.64 23.42,8.38 C102.P$2
N$2
  Top 0.245: U101.12 22.45,10.16 22.45,9.35 22.25,9.14 22.25,8.84 C101.P$1 | 22.51,8.69 C101.P$1 | C101.P$1 22.05,8.33 22.05,7.72 20.42,6.1 20.22,6.1 19.58,6.73 X101.3
N$4
  Bottom 0.2: 42.16,15.75 42.47,16.05 42.77,16.05
  Bottom 0.254: J402.P$2 42.35,14.14 42.16,14.33 42.16,15.75 | 42.77,16.05 42.98,16.26 42.98,18.49 42.47,19 42.47,19.3 42.2,19.58 L402.P$15
N$5
  Bottom 0.254: U$202.4 11.51,8.71 11.15,9.06 11.15,10.46 11.26,10.56 12.15,10.56 12.4,10.81 JP202.1
N$6
  Top 0.406: D901.1 16.66,4.03 R901.P$1 R902.P$2
N$7
  Top 0.254: R805.P$2 44.81,17.68 45.01,17.88 LED802.C
N$8
  Top 0.254: C718.P$1 32.11,27.08 32.11,26.17 U101.73
N$9
  Top 0.406: R706.P$2 24.48,2.89 D701.CATHODE
N$10
  Top 0.254: 16.51,19.41 13.72,19.41 13.41,19.1 12.63,19.1 U$601.14
  pour Top (no thermals): 12.6,19.51 17.48,19.51 17.48,18.8 12.6,18.8
N$11
  Top 0.254: U$701.6 17.13,15.19 17.48,15.54 C703.P$2
N$12
  Top 0.254: 39.52,13.61 39.48,13.61 U101.49
  Top 0.305: C716.P$1 40.23,13.61 39.52,13.61
N$13
  Top 0.254: R803.P$1 42.88,18.8 42.37,18.29 42.37,17.38 R804.P$2
N$15
  Bottom 0.2: L1001.P$9 9.53,24.77 9.45,24.69 9.45,23.67 8.94,23.16 8.94,16.36 8.64,16.05 8.64,14.22 8.23,13.82 8.23,12.5 7.93,12.19 7.93,11.58 J1001.S8
N$16
  Bottom 0.2: J1001.S7 8.23,14.43 8.23,16.15 8.54,16.46 8.54,23.37 9.04,23.88 9.04,25.09 9.15,25.2 9.65,25.2 9.72,25.27 L1001.P$10
N$17
  Top 0.254: U$601.1 13.97,22.1 14.43,21.64 15.9,21.64 L$601.2
  pour Top (no thermals): 12.6,21.84 13.81,21.84 14.02,21.64 17.48,21.64 17.48,22.35 12.6,22.35 12.6,22.35
N$18  (via drill 0.3 pad 0.55)
  Horizontal 0.61: U$201.1 8.66,7.11 11.08,4.69 11.08,4.37 11.58,3.86 15.44,3.86 16.66,5.08 16.66,6.4 v16.46,6.6
  Bottom 0.254: L202.P$14 16.52,6.67 v16.46,6.6 16.56,6.71 16.97,6.71 17.02,6.76 L202.P$13
N$19
  Top 0.254: R1001.P$1 28.05,2.76 28.46,2.76 28.86,2.36 JP1001.P$1
N$20
  Bottom 0.2: 41.66,13.86 41.66,16.16 41.66,17.06 41.66,17.07
  Bottom 0.254: J402.P$3 42.08,12.89 41.86,13.11 41.86,13.65 41.66,13.86 | L402.P$16 41.88,19.08 42.06,18.9 42.06,18.59 41.66,18.19 41.66,17.07
N$21
  Bottom 0.305: U$401.C 43.89,16.46
  Bottom 0.406: L403.P$2 47.03,10.55 47.35,10.87 47.35,16.15 47.04,16.46 43.89,16.46 43.69,16.46 43.48,16.26 43.48,15.4 J402.P$1
N$22
  Top 0.254: R408.P$2 29.46,31.61 SJ403.1
N$23
  Top 0.254: R1002.P$1 JP1002.P$1
N$26
  Top 0.2: R803.P$2 44.36,18.86 44.36,19.56 45.26,19.56 45.36,19.66 45.46,19.56 LED801.C
N$27  (via drill 0.3 pad 0.55)
  Top 0.254: U$601.10 10.21,19.15 v9.96,18.9
  Bottom 0.2: C603.P$1 10.96,18.76 10.96,19.16 10.26,19.16 10.16,19.1
  Bottom 0.254: v9.96,18.9 10.16,19.1
N$28
  Bottom 0.406: U$403.C L405.P$2 19.71,31.09 18.39,32.41 15.54,32.41 14.69,31.55 J404.P$1
N$29
  Top 0.254: SJ402.1 18.79,31.61 R407.P$2
N$33
  Bottom 0.254: L402.P$9 41.44,23.05 42.16,23.77 42.16,24.38 42.37,24.59 43.48,24.59 J403.P$2
  Bottom 0.406: J403.P$2 43.48,24.59
N$34
  Top 0.254: U$703.7 16.51,12.75 R704.P$1
N$36
  Bottom 0.2: J1001.S6 8.13,16.87 8.13,23.57 8.64,24.08 8.64,25.4 8.84,25.6 9.45,25.6 9.61,25.77 L1001.P$11
N$37
  Bottom 0.254: L402.P$10 41.79,22.08 42.16,22.45 42.16,23.16 42.27,23.27 43.41,23.27 J403.P$3
N$41
  Bottom 0.406: L401.P$2 34.85,24.38 34.34,24.89 34.34,27.03 34.14,27.23 25.2,27.23 24.99,27.03 24.99,23.98 25.49,23.48 J401.P$1
N$42
  Bottom 0.305: L404.P$2 43.89,20.92 U$402.C
  Bottom 0.406: L404.P$2 46.55,20.93 46.96,21.34 46.96,22.32 46.52,22.76 45.66,22.76 45.16,23.32 45.16,25.56 44.86,25.86 J403.P$1
N$48
  Bottom 0.406: L406.P$2 30.58,29.87 30.28,30.17 30.28,32 29.87,32.41 25.6,32.41 25.3,32.11 25.3,29.94 J405.P$1 25.34,29.87 24.28,29.87 24.08,30.07 U$404.C
N$57  (via drill 0.3 pad 0.55)
  Top 0.305: R801.P$1 v18.8,27.02
  Bottom 0.305: v18.8,27.02 J801.P$2
N$68  (via drill 0.3 pad 0.55)
  Vertical 0.254: J1001.S5 7.86,19.16 7.86,20.03 8.64,20.81 8.64,25.91 v9.06,26.3
  Bottom 0.2: v9.06,26.3 9.09,26.27 L1001.P$12
N$77  (via drill 0.3 pad 0.55)
  Vertical 0.254: J1001.S4 7.27,20.57 8.13,21.44 8.13,26.31 v8.84,27.03
  Bottom 0.2: v8.84,27.03 9.15,27.03 9.4,26.77 L1001.P$13
N$78
  Bottom 0.2: J1001.S3 8.13,24.49 8.13,27.03 8.33,27.23 8.33,27.43 8.54,27.63 9.04,27.63 9.41,27.27 L1001.P$14
N$79
  Bottom 0.2: J1001.S2 7.62,26.52 7.62,27.13 7.96,27.46 7.96,27.97 8.03,28.04 9.15,28.04 9.42,27.77 L1001.P$15
N$104
  Top 0.254: U$702.6 44.46,13.16 44.4,13.11 C704.P$1
OTG_DM1  (via drill 0.3 pad 0.55)
  Top 0.254: U$301.3 38.3,31.36 v38.41,31.25
  Bottom 0.254: 38.41,29.87 J301.P$3 38.41,29.9 v38.41,31.25
OTG_DP1  (via drill 0.3 pad 0.55)
  Top 0.254: U$301.1 37.3,31.46 v37.19,31.25
  Bottom 0.2: 37.19,29.86 37.26,29.86 J301.P$2
  Bottom 0.254: v37.19,31.25 37.19,29.86
OTG_FS_DM
  Top 0.254: U101.70 34.64,26.59 34.64,29.37 34.36,29.66 34.34,31.89 35.05,32.6 38,32.6 38.3,32.9 U$301.4
OTG_FS_DP
  Top 0.254: U$301.6 35.01,33.28 33.93,32.2 33.93,29.48 34.23,29.18 34.23,26.88 U101.71
PB2-BOOT1
  Top 0.254: U101.37 R101.P$1 | R101.P$1
PPM_INPUT  (via drill 0.3 pad 0.55)
  Top 0.154: 25.96,3.86 23.86,3.86
  Top 0.2: 23.86,3.86 23.46,3.46 21.66,3.46 20.05,5.06 19.36,5.06 17.55,6.86 17.55,8.66 v16.45,9.75 | 25.96,3.86 26.26,4.16 26.26,6.26 26.96,6.96 U101.23
  Bottom 0.254: L202.P$3 16.52,9.68 v16.45,9.75 16.45,10.06 15.96,10.56 14.65,10.56 14.11,10.01 U$202.1
REGD
  Top 0.254: U$501.13 42.48,8.01 42.66,7.76 43.14,7.76 C503.P$1
SAFETY  (via drill 0.3 pad 0.55)
  Top 0.305: R802.P$1 17.48,26.92 v17.58,27.02
  Bottom 0.305: v17.58,27.02 17.58,25.62 J801.P$3
SDIO_CK  (via drill 0.3 pad 0.55)
  Top 0.2: v27.46,20.46 27.46,23.52 U101.80 26.36,24.66
  Top 0.254: U$302.6 40.13,26.73 v40.05,26.66
  Horizontal 0.2: v30.96,20.56 29.86,20.56 29.76,20.46 v27.46,20.46
  Bottom 0.2: v30.96,20.56 36.36,20.56 38.46,22.66 38.46,25.06 v40.05,26.66
SDIO_CMD  (via drill 0.3 pad 0.55)
  Top 0.2: v23.55,24.56 24.26,24.56 25.26,23.56 U101.83
  Top 0.254: U$302.1 47.12,24.19 v47.16,24.16
  Horizontal 0.2: v47.16,24.16 45.76,22.66 38.26,22.66 37.36,23.56 25.16,23.56 24.16,24.56 v23.55,24.56
SDIO_D0
  Top 0.2: 35.16,23.56 34.16,22.56 U101.65
  Top 0.254: 35.16,23.56 35.96,24.36 35.96,24.76 38.8,27.6 39.8,27.6 40.16,27.96 40.91,27.96 U$302.5
SDIO_D1  (via drill 0.3)